# EAGLE schematic MainECU rev12 (EAGLE 9.6.2)

## Sheet 1 of 8
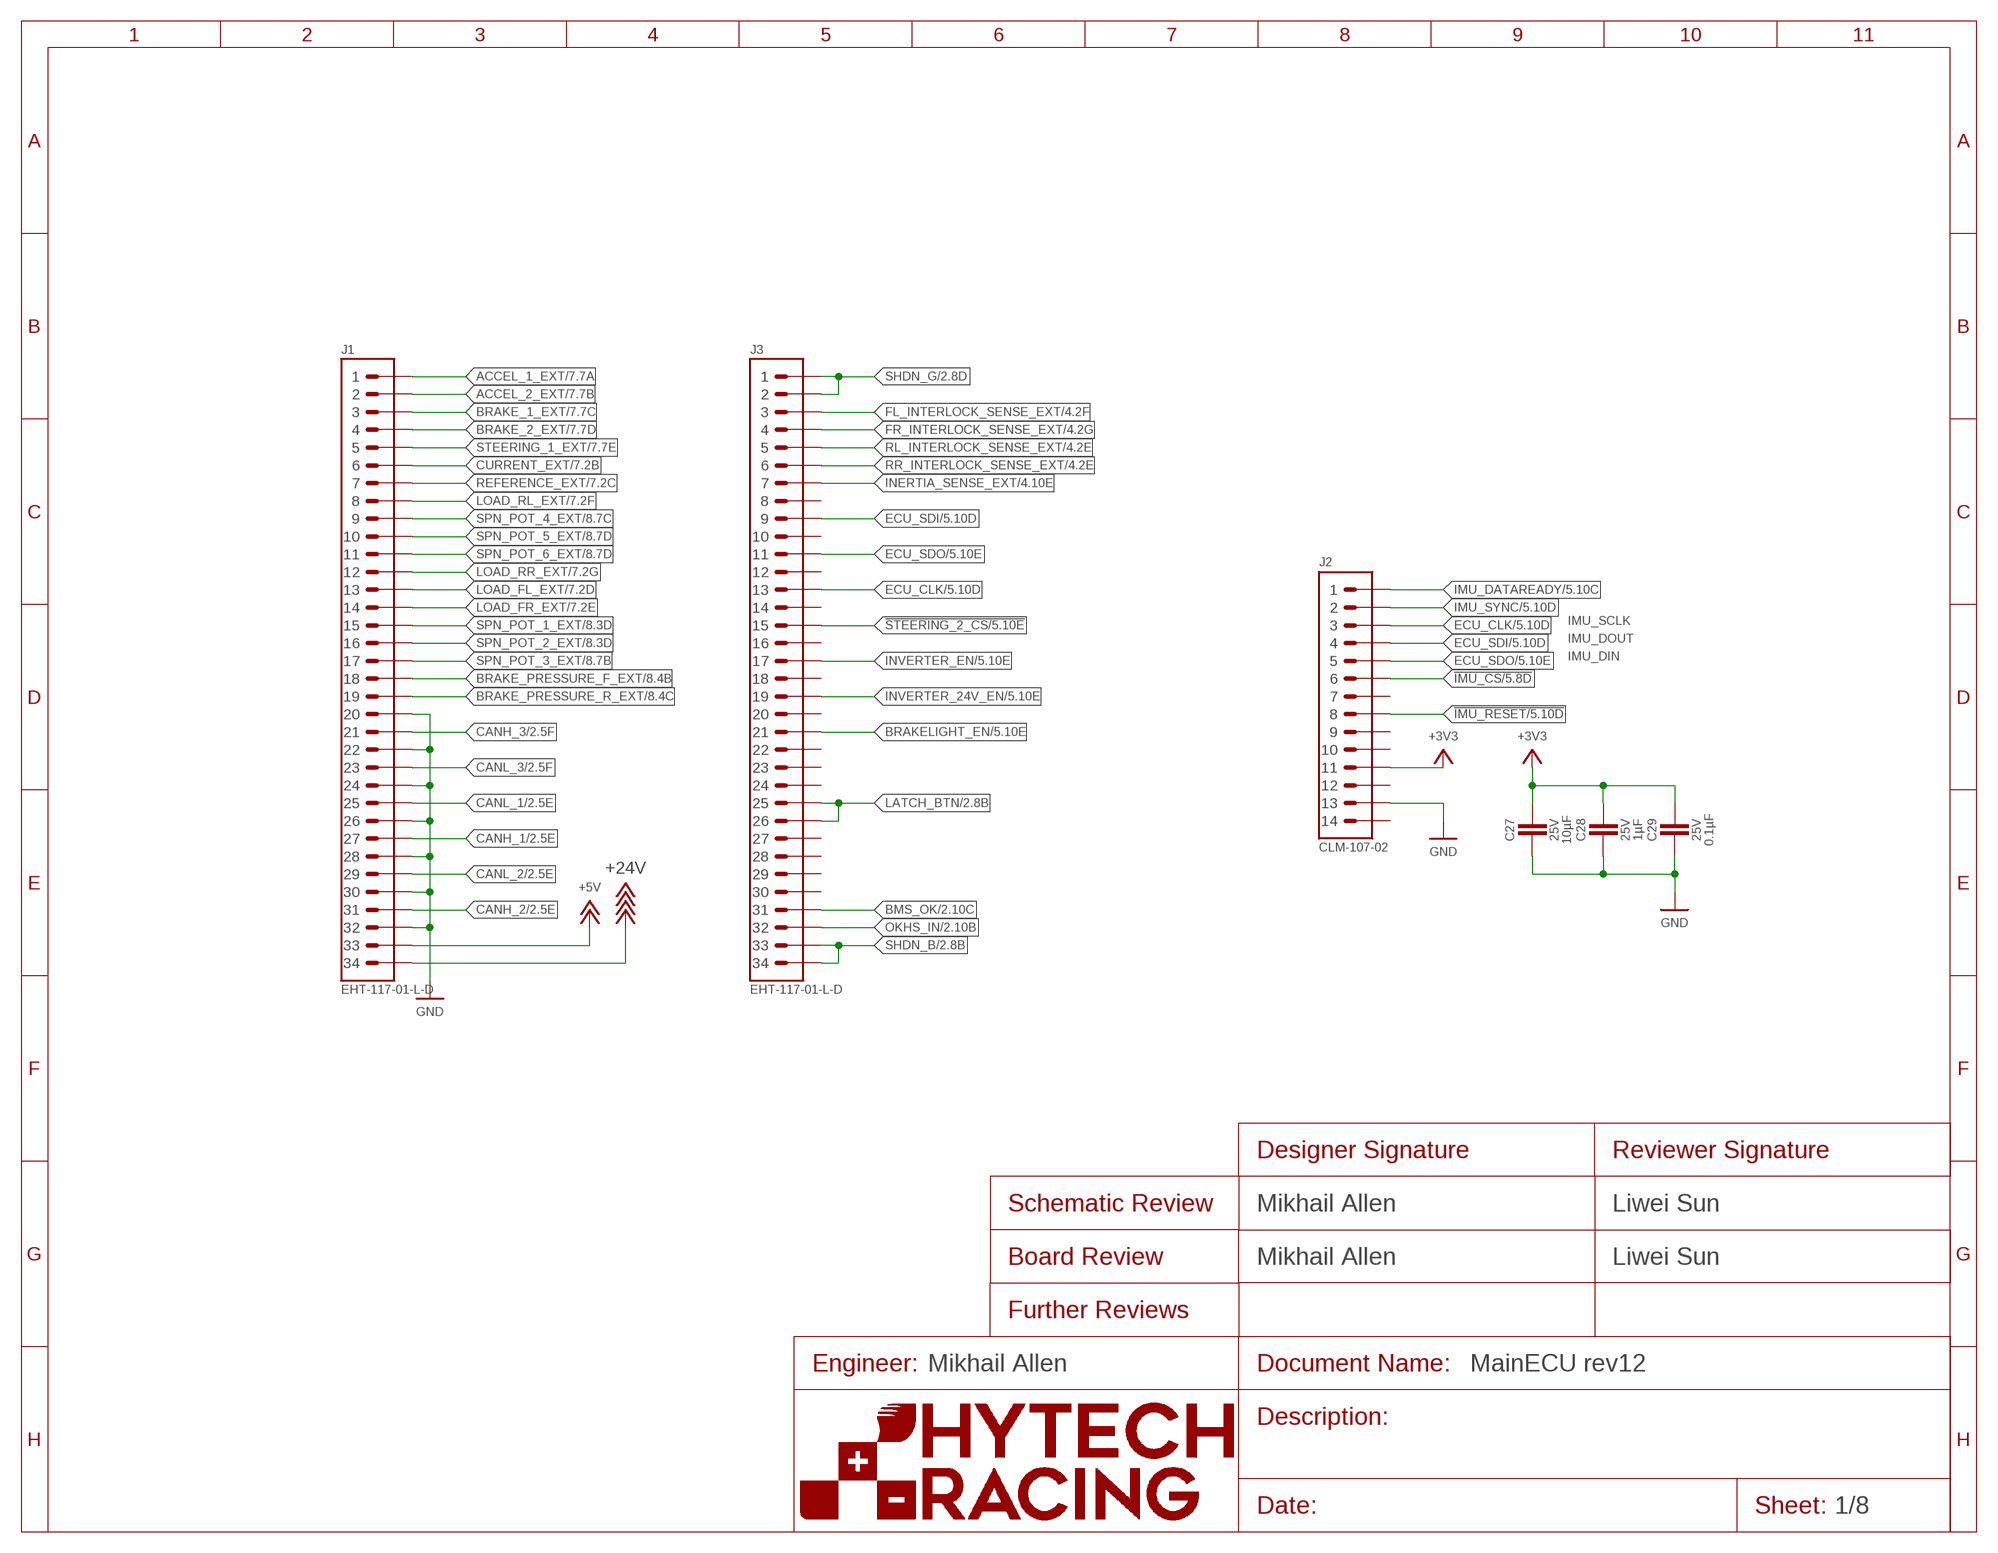
[diagram p0: schematic, sheet 1]
FRAME8 (FRAME): DESIGNER_BOARD: Mikhail Allen; DESIGNER_SCHEMATIC: Mikhail Allen; ENGINEER: Mikhail Allen; REVIEWER_BOARD: Liwei Sun; REVIEWER_SCHEMATIC: Liwei Sun

### Parts
C27  CAPACITOR_0603_25V_10UF  [0603-CAP]
C28  CAPACITOR_0603_25V_1UF  [0603-CAP]
C29  CAPACITOR_0603_25V_0.1UF  [0603-CAP]
J1  CONNECTOR-34__  [EHT-117-01]
J2  ADIS16460  [ADIS16460]
J3  CONNECTOR-34__  [EHT-117-01]

### Nets
!IMU_CS: J2.6 ; also sheet 5
!IMU_RESET: J2.8 ; also sheet 5
!STEERING_2_CS: J3.15 ; also sheet 5
+3V3: C27.1 C28.1 C29.1 J2.11 ; also sheet 2,4,5,6
+5V: J1.33 ; also sheet 2,3,5,6,7
+24V: J1.34 ; also sheet 2,3,4,6
ACCEL_1_EXT: J1.1 ; also sheet 7
ACCEL_2_EXT: J1.2 ; also sheet 7
BMS_OK: J3.31 ; also sheet 2,4
BRAKE_1_EXT: J1.3 ; also sheet 7
BRAKE_2_EXT: J1.4 ; also sheet 7
BRAKE_PRESSURE_F_EXT: J1.18 ; also sheet 8
BRAKE_PRESSURE_R_EXT: J1.19 ; also sheet 8
BRAKELIGHT_EN: J3.21 ; also sheet 5
CANH_1: J1.27 ; also sheet 2,5,6
CANH_2: J1.31 ; also sheet 2,5,6
CANH_3: J1.21 ; also sheet 2,5,6
CANL_1: J1.25 ; also sheet 2,5,6
CANL_2: J1.29 ; also sheet 2,5,6
CANL_3: J1.23 ; also sheet 2,5,6
CURRENT_EXT: J1.6 ; also sheet 7
ECU_CLK: J2.3 J3.13 ; also sheet 5
ECU_SDI: J2.4 J3.9 ; also sheet 5
ECU_SDO: J2.5 J3.11 ; also sheet 5
FL_INTERLOCK_SENSE_EXT: J3.3 ; also sheet 4
FR_INTERLOCK_SENSE_EXT: J3.4 ; also sheet 4
GND: C27.2 C28.2 C29.2 J1.20 J1.22 J1.24 J1.26 J1.28 J1.30 J1.32 J2.13 ; also sheet 2,3,4,5,6,7,8
IMU_DATAREADY: J2.1 ; also sheet 5
IMU_SYNC: J2.2 ; also sheet 5
INERTIA_SENSE_EXT: J3.7 ; also sheet 4
INVERTER_24V_EN: J3.19 ; also sheet 5
INVERTER_EN: J3.17 ; also sheet 5
LATCH_BTN: J3.25 J3.26 ; also sheet 2,4
LOAD_FL_EXT: J1.13 ; also sheet 7
LOAD_FR_EXT: J1.14 ; also sheet 7
LOAD_RL_EXT: J1.8 ; also sheet 7
LOAD_RR_EXT: J1.12 ; also sheet 7
OKHS_IN: J3.32 ; also sheet 2,4
REFERENCE_EXT: J1.7 ; also sheet 7
RL_INTERLOCK_SENSE_EXT: J3.5 ; also sheet 4
RR_INTERLOCK_SENSE_EXT: J3.6 ; also sheet 4
SHDN_B: J3.33 J3.34 ; also sheet 2,4
SHDN_G: J3.1 J3.2 ; also sheet 2,4
SPN_POT_1_EXT: J1.15 ; also sheet 8
SPN_POT_2_EXT: J1.16 ; also sheet 8
SPN_POT_3_EXT: J1.17 ; also sheet 8
SPN_POT_4_EXT: J1.9 ; also sheet 8
SPN_POT_5_EXT: J1.10 ; also sheet 8
SPN_POT_6_EXT: J1.11 ; also sheet 8
STEERING_1_EXT: J1.5 ; also sheet 7
Unconnected: J2.7 J2.9 J2.10 J2.12 J2.14 J3.8 J3.10 J3.12 J3.14 J3.16 J3.18 J3.20 J3.22 J3.23 J3.24 J3.27 J3.28 J3.29 J3.30

### Notes on the sheet
- IMU_SCLK
- IMU_DOUT
- IMU_DIN

## Sheet 2 of 8
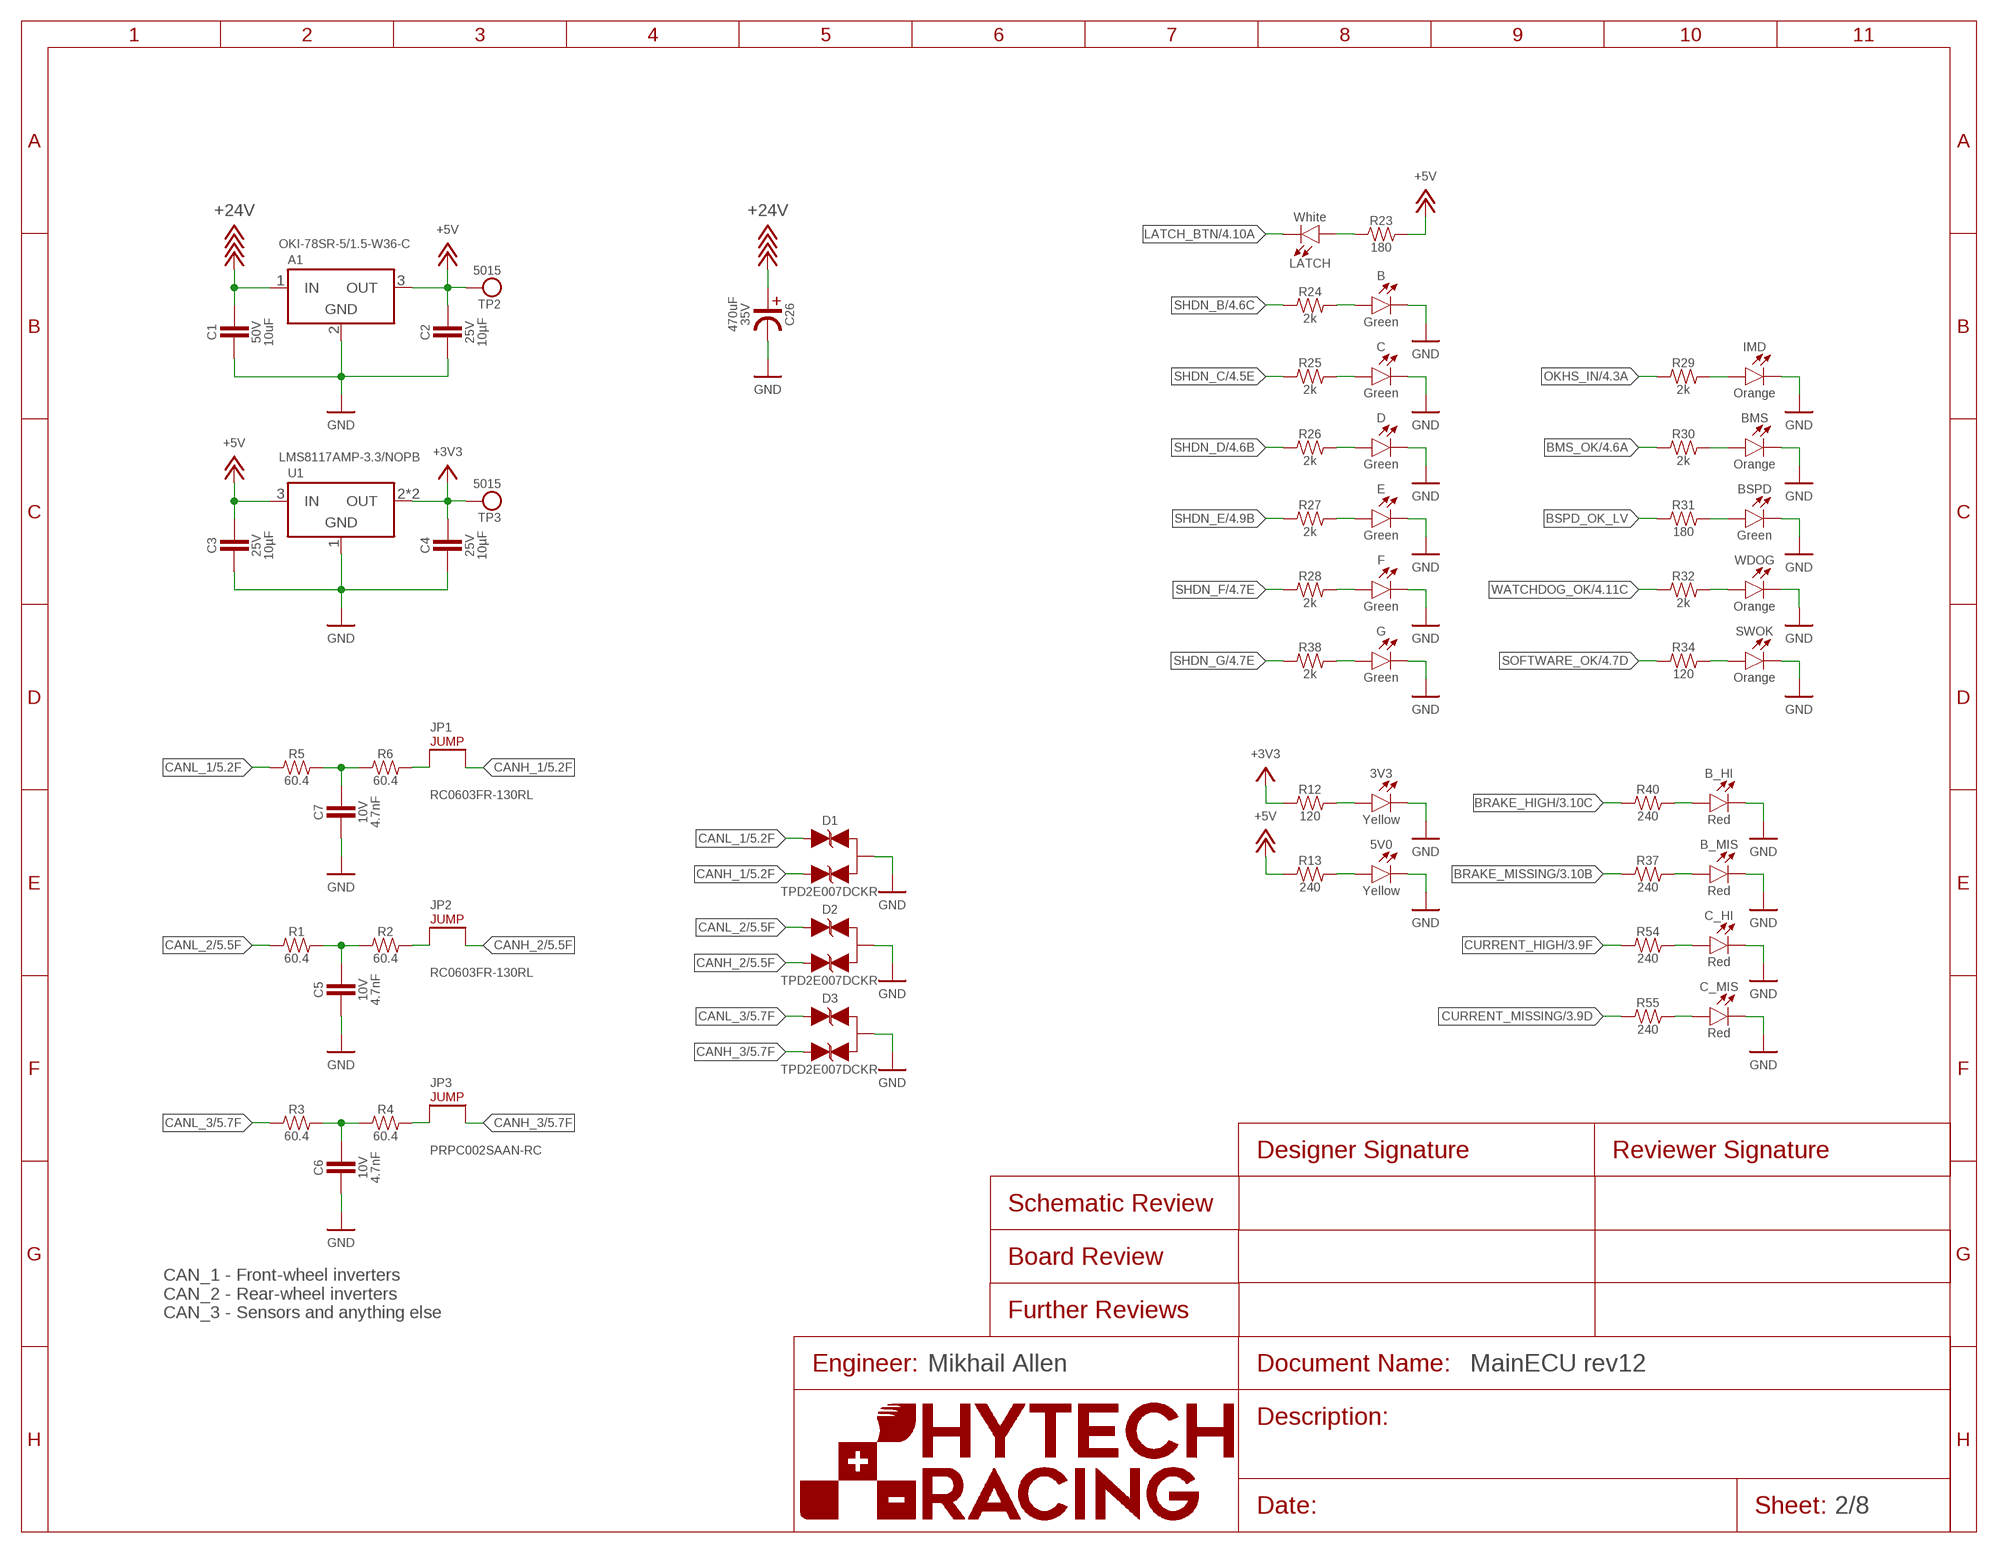
[diagram p1: schematic, sheet 2]
FRAME1 (FRAME): ENGINEER: Mikhail Allen

### Parts
3V3  LED_0603_YELLOW  [0603-LED]
5V0  LED_0603_YELLOW  [0603-LED]
A1  VOLTAGE_REGULATOR_MODULE_OKI-78SR_5V  [OKI-78SR]
B  LED_0603_GREEN  [0603-LED]
B_HI  LED_0603_RED  [0603-LED]
B_MIS  LED_0603_RED  [0603-LED]
BMS  LED_0603_ORANGE  [0603-LED]
BSPD  LED_0603_GREEN  [0603-LED]
C  LED_0603_GREEN  [0603-LED]
C1  CAPACITOR_0805_50V_10UF  [0805-CAP]
C2  CAPACITOR_0603_25V_10UF  [0603-CAP]
C3  CAPACITOR_0603_25V_10UF  [0603-CAP]
C4  CAPACITOR_0603_25V_10UF  [0603-CAP]
C5  CAPACITOR_0603_10V_4.7NF  [0603-CAP]
C6  CAPACITOR_0603_10V_4.7NF  [0603-CAP]
C7  CAPACITOR_0603_10V_4.7NF  [0603-CAP]
C26  CAPACITOR_ELECTROLYTIC_EEH_AZS_470UF  [EEH-AZS]
C_HI  LED_0603_RED  [0603-LED]
C_MIS  LED_0603_RED  [0603-LED]
D  LED_0603_GREEN  [0603-LED]
D1  TVS_BIDIRECTIONAL_DUAL  [SC-70-3]
D2  TVS_BIDIRECTIONAL_DUAL  [SC-70-3]
D3  TVS_BIDIRECTIONAL_DUAL  [SC-70-3]
E  LED_0603_GREEN  [0603-LED]
F  LED_0603_GREEN  [0603-LED]
G  LED_0603_GREEN  [0603-LED]
IMD  LED_0603_ORANGE  [0603-LED]
JP1  JUMPER_0603_  [0603-RES]
JP2  JUMPER_0603_  [0603-RES]
JP3  JUMPER__1X02  [1X02]
LATCH  LED_0603_WHITE  [0603-LED]
R1  RESISTOR_0603_60.4  [0603-RES]
R2  RESISTOR_0603_60.4  [0603-RES]
R3  RESISTOR_0603_60.4  [0603-RES]
R4  RESISTOR_0603_60.4  [0603-RES]
R5  RESISTOR_0603_60.4  [0603-RES]
R6  RESISTOR_0603_60.4  [0603-RES]
R12  RESISTOR_0603_120  [0603-RES]
R13  RESISTOR_0603_240  [0603-RES]
R23  RESISTOR_0603_180  [0603-RES]
R24  RESISTOR_0603_2K  [0603-RES]
R25  RESISTOR_0603_2K  [0603-RES]
R26  RESISTOR_0603_2K  [0603-RES]
R27  RESISTOR_0603_2K  [0603-RES]
R28  RESISTOR_0603_2K  [0603-RES]
R29  RESISTOR_0603_2K  [0603-RES]
R30  RESISTOR_0603_2K  [0603-RES]
R31  RESISTOR_0603_180  [0603-RES]
R32  RESISTOR_0603_2K  [0603-RES]
R34  RESISTOR_0603_120  [0603-RES]
R37  RESISTOR_0603_240  [0603-RES]
R38  RESISTOR_0603_2K  [0603-RES]
R40  RESISTOR_0603_240  [0603-RES]
R54  RESISTOR_0603_240  [0603-RES]
R55  RESISTOR_0603_240  [0603-RES]
SWOK  LED_0603_ORANGE  [0603-LED]
TP2  TEST_POINT  [5015]
TP3  TEST_POINT  [5015]
U1  VOLTAGE_REGULATOR_SOT-223_3.3V  [SOT-223]
WDOG  LED_0603_ORANGE  [0603-LED]

### Nets
+3V3: C4.1 R12.1 TP3.1 U1.2(OUT) U1.4(OUT) ; also sheet 1,4,5,6
+5V: A1.3(OUT) C2.1 C3.1 R13.1 R23.2 TP2.1 U1.3(IN) ; also sheet 1,3,5,6,7
+24V: A1.1(IN) C1.1 C26.PLUS ; also sheet 1,3,4,6
BMS_OK: R30.1 ; also sheet 1,4
BRAKE_HIGH: R40.1 ; also sheet 3
BRAKE_MISSING: R37.1 ; also sheet 3
BSPD_OK_LV: R31.1 ; also sheet 3
CANH_1: D1.2(C2) JP1.2 ; also sheet 1,5,6
CANH_2: D2.2(C2) JP2.2 ; also sheet 1,5,6
CANH_3: D3.2(C2) JP3.2 ; also sheet 1,5,6
CANL_1: D1.1(C1) R5.1 ; also sheet 1,5,6
CANL_2: D2.1(C1) R1.1 ; also sheet 1,5,6
CANL_3: D3.1(C1) R3.1 ; also sheet 1,5,6
CURRENT_HIGH: R54.1 ; also sheet 3
CURRENT_MISSING: R55.1 ; also sheet 3
GND: 3V3.1(C) 5V0.1(C) A1.2(GND) B.1(C) B_HI.1(C) B_MIS.1(C) BMS.1(C) BSPD.1(C) C1.2 C2.2 C3.2 C4.2 C5.2 C6.2 C7.2 C26.MINUS C.1(C) C_HI.1(C) C_MIS.1(C) D1.3(A) D2.3(A) D3.3(A) D.1(C) E.1(C) F.1(C) G.1(C) IMD.1(C) SWOK.1(C) U1.1(GND) WDOG.1(C) ; also sheet 1,3,4,5,6,7,8
LATCH_BTN: LATCH.1(C) ; also sheet 1,4
N$1: JP1.1 R6.2
N$2: JP2.1 R2.2
N$6: JP3.1 R4.2
N$7: C5.1 R1.2 R2.1
N$8: C6.1 R3.2 R4.1
N$9: C7.1 R5.2 R6.1
N$13: G.2(A) R38.2
N$15: LATCH.2(A) R23.1
N$16: B.2(A) R24.2
N$17: C.2(A) R25.2
N$18: D.2(A) R26.2
N$19: E.2(A) R27.2
N$20: F.2(A) R28.2
N$28: B_MIS.2(A) R37.2
N$29: C_HI.2(A) R54.2
N$30: C_MIS.2(A) R55.2
N$40: IMD.2(A) R29.2
N$41: BMS.2(A) R30.2
N$42: BSPD.2(A) R31.2
N$43: R32.2 WDOG.2(A)
N$44: 3V3.2(A) R12.2
N$45: R34.2 SWOK.2(A)
N$47: 5V0.2(A) R13.2
N$56: B_HI.2(A) R40.2
OKHS_IN: R29.1 ; also sheet 1,4
SHDN_B: R24.1 ; also sheet 1,4
SHDN_C: R25.1 ; also sheet 4
SHDN_D: R26.1 ; also sheet 4
SHDN_E: R27.1 ; also sheet 4
SHDN_F: R28.1 ; also sheet 4
SHDN_G: R38.1 ; also sheet 1,4
SOFTWARE_OK: R34.1 ; also sheet 4,5
WATCHDOG_OK: R32.1 ; also sheet 4

### Notes on the sheet
- CAN_1 - Front-wheel inverters
  CAN_2 - Rear-wheel inverters
  CAN_3 - Sensors and anything else

## Sheet 3 of 8
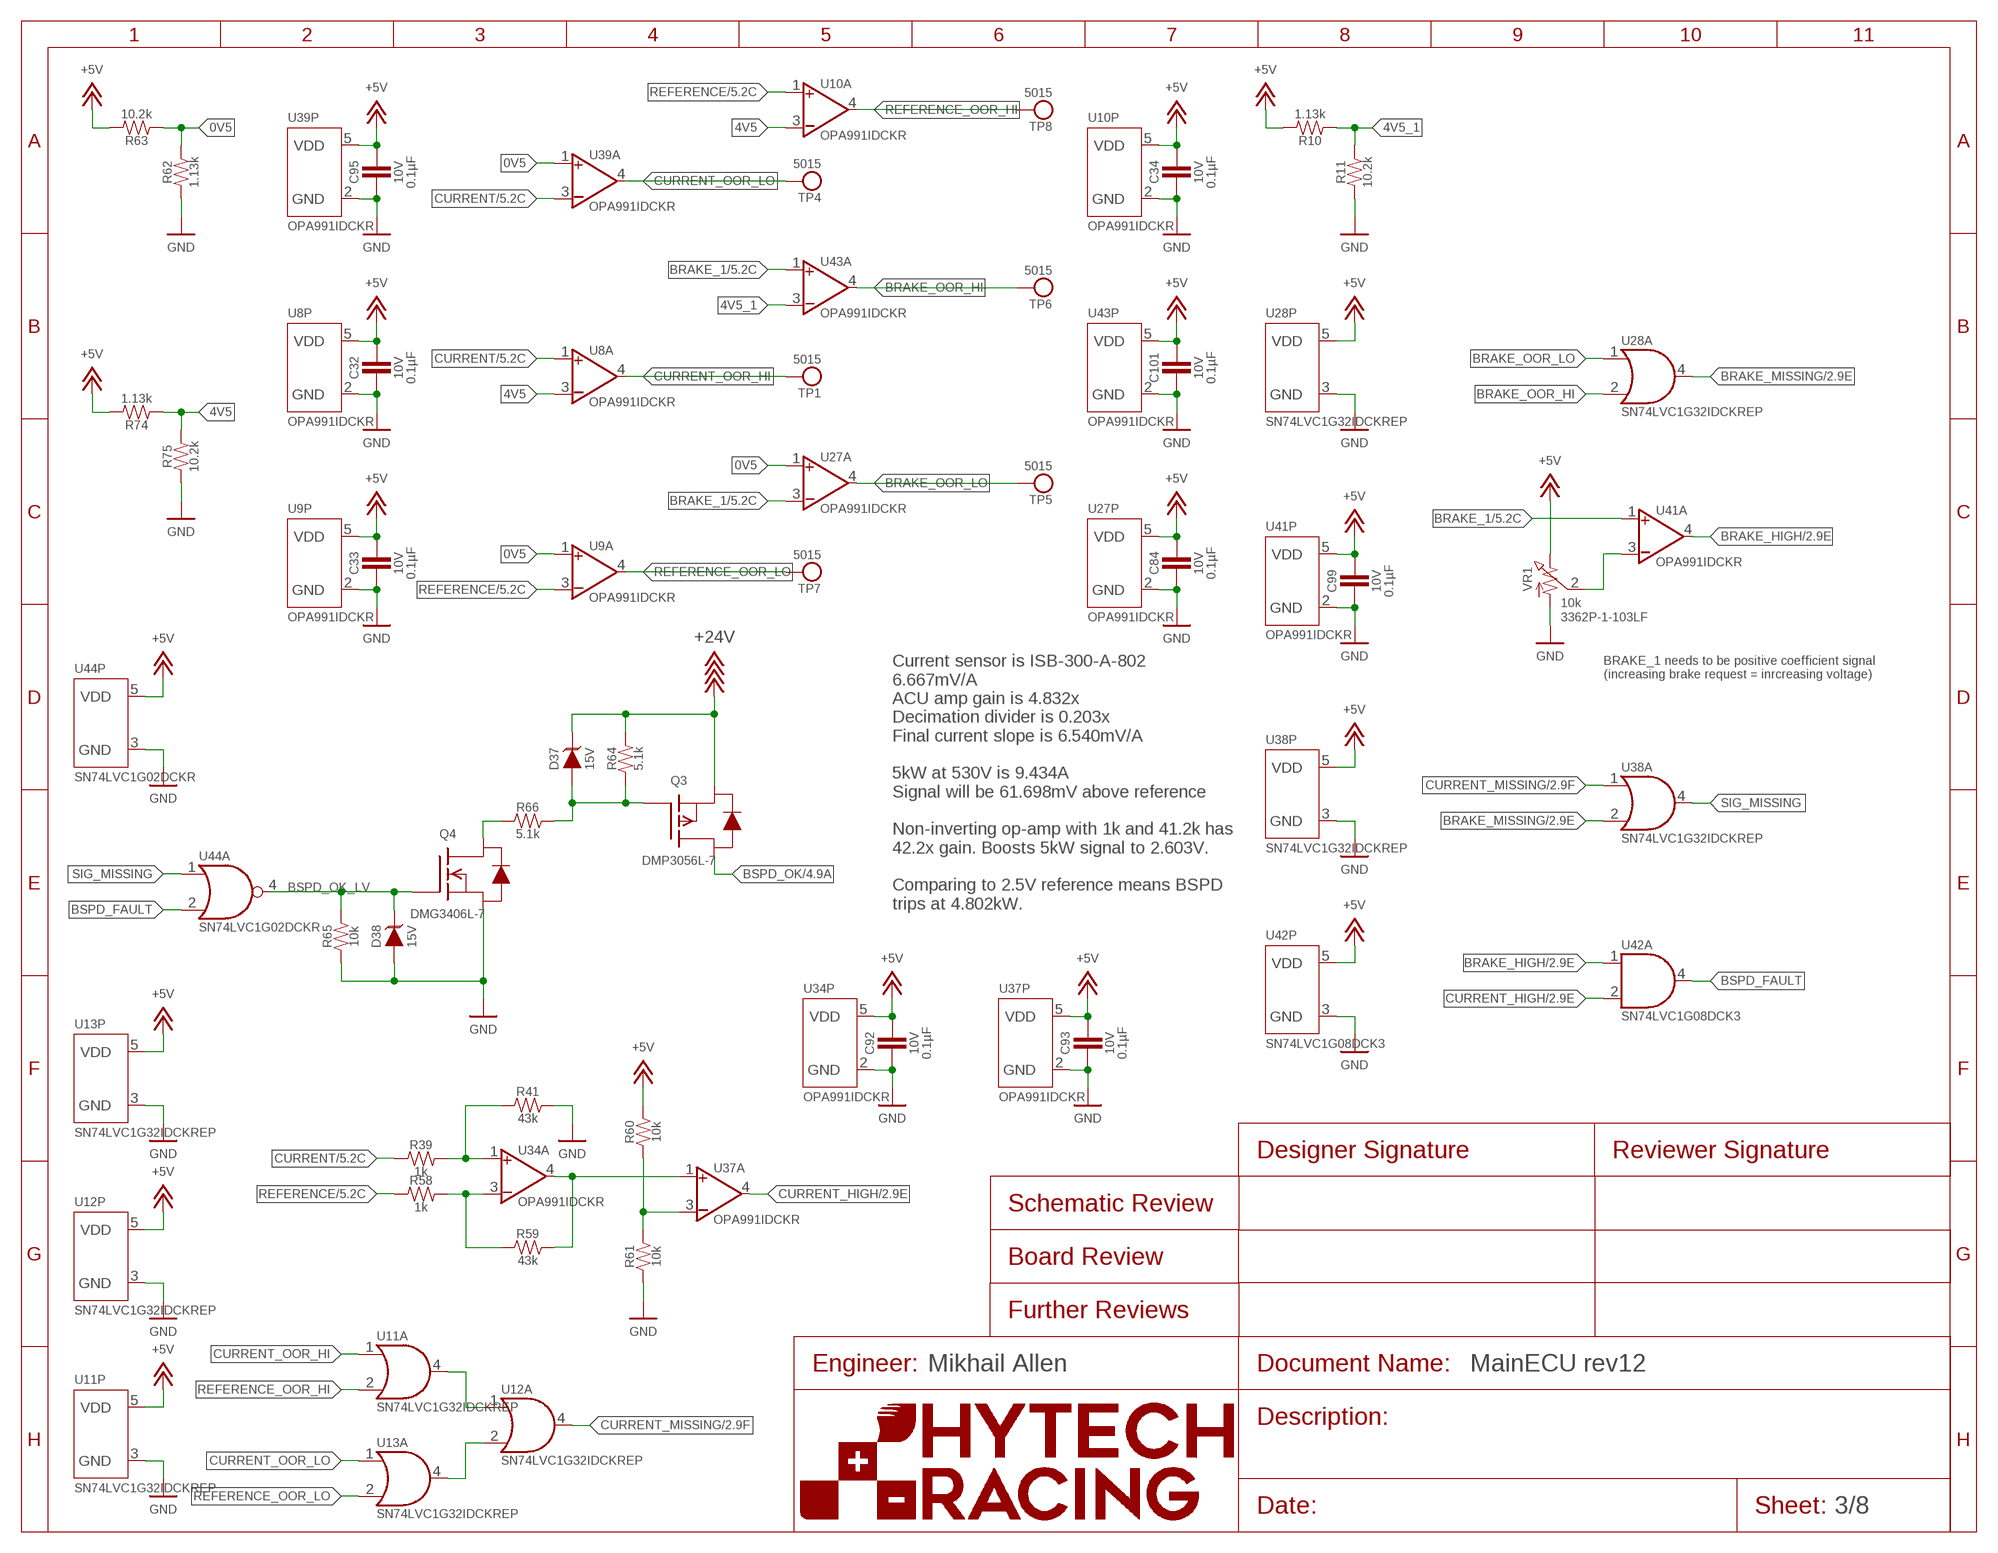
[diagram p2: schematic, sheet 3]
FRAME7 (FRAME): ENGINEER: Mikhail Allen

### Parts
C32  CAPACITOR_0603_10V_0.1UF  [0603-CAP]
C33  CAPACITOR_0603_10V_0.1UF  [0603-CAP]
C34  CAPACITOR_0603_10V_0.1UF  [0603-CAP]
C84  CAPACITOR_0603_10V_0.1UF  [0603-CAP]
C92  CAPACITOR_0603_10V_0.1UF  [0603-CAP]
C93  CAPACITOR_0603_10V_0.1UF  [0603-CAP]
C95  CAPACITOR_0603_10V_0.1UF  [0603-CAP]
C99  CAPACITOR_0603_10V_0.1UF  [0603-CAP]
C101  CAPACITOR_0603_10V_0.1UF  [0603-CAP]
D37  TVS__15V  [SOT-23]
D38  TVS__15V  [SOT-23]
Q3  TRANSISTOR_P_MOS_SOT-23_DMP3056L-7  [SOT-23]
Q4  TRANSISTOR_N_MOS__DMG3406L-7  [SOT-23]
R10  RESISTOR_0603_1.13K  [0603-RES]
R11  RESISTOR_0603_10.2K  [0603-RES]
R39  RESISTOR_0603_1K  [0603-RES]
R41  RESISTOR_0603_43K  [0603-RES]
R58  RESISTOR_0603_1K  [0603-RES]
R59  RESISTOR_0603_43K  [0603-RES]
R60  RESISTOR_0603_10K  [0603-RES]
R61  RESISTOR_0603_10K  [0603-RES]
R62  RESISTOR_0603_1.13K  [0603-RES]
R63  RESISTOR_0603_10.2K  [0603-RES]
R64  RESISTOR_0603_5.1K  [0603-RES]
R65  RESISTOR_0603_10K  [0603-RES]
R66  RESISTOR_0603_5.1K  [0603-RES]
R74  RESISTOR_0603_1.13K  [0603-RES]
R75  RESISTOR_0603_10.2K  [0603-RES]
TP1  TEST_POINT  [5015]
TP4  TEST_POINT  [5015]
TP5  TEST_POINT  [5015]
TP6  TEST_POINT  [5015]
TP7  TEST_POINT  [5015]
TP8  TEST_POINT  [5015]
U8  OPAMP_1_CHANNEL_OPA991  [SC-70-5]
U9  OPAMP_1_CHANNEL_OPA991  [SC-70-5]
U10  OPAMP_1_CHANNEL_OPA991  [SC-70-5]
U11  LOGICGATE_OR  [SC-70-5]
U12  LOGICGATE_OR  [SC-70-5]
U13  LOGICGATE_OR  [SC-70-5]
U27  OPAMP_1_CHANNEL_OPA991  [SC-70-5]
U28  LOGICGATE_OR  [SC-70-5]
U34  OPAMP_1_CHANNEL_OPA991  [SC-70-5]
U37  OPAMP_1_CHANNEL_OPA991  [SC-70-5]
U38  LOGICGATE_OR  [SC-70-5]
U39  OPAMP_1_CHANNEL_OPA991  [SC-70-5]
U41  OPAMP_1_CHANNEL_OPA991  [SC-70-5]
U42  LOGICGATE_AND_DCK3  [SC-70-5]
U43  OPAMP_1_CHANNEL_OPA991  [SC-70-5]
U44  LOGICGATE_NOR  [SC-70-5]
VR1  RESISTOR_TRIMPOT_10K_3362P  [3362P]

### Nets
0V5: R62.2 R63.1 U9.1(A:VIN+) U27.1(A:VIN+) U39.1(A:VIN+)
4V5: R74.1 R75.2 U8.3(A:VIN-) U10.3(A:VIN-)
4V5_1: R10.1 R11.2 U43.3(A:VIN-)
+5V: C32.1 C33.1 C34.1 C84.1 C92.1 C93.1 C95.1 C99.1 C101.1 R10.2 R60.2 R63.2 R74.2 U8.5(P:VDD) U9.5(P:VDD) U10.5(P:VDD) U11.5(P:VDD) U12.5(P:VDD) U13.5(P:VDD) U27.5(P:VDD) U28.5(P:VDD) U34.5(P:VDD) U37.5(P:VDD) U38.5(P:VDD) U39.5(P:VDD) U41.5(P:VDD) U42.5(P:VDD) U43.5(P:VDD) U44.5(P:VDD) VR1.3 ; also sheet 1,2,5,6,7
+24V: D37.3(C) Q3.2(S) R64.2 ; also sheet 1,2,4,6
BRAKE_1: U27.3(A:VIN-) U41.1(A:VIN+) U43.1(A:VIN+) ; also sheet 5,7
BRAKE_HIGH: U41.4(A:VOUT) U42.1(A:IN1) ; also sheet 2
BRAKE_MISSING: U28.4(A:OUT) U38.2(A:IN2) ; also sheet 2
BRAKE_OOR_HI: TP6.1 U28.2(A:IN2) U43.4(A:VOUT)
BRAKE_OOR_LO: TP5.1 U27.4(A:VOUT) U28.1(A:IN1)
BSPD_FAULT: U42.4(A:OUT) U44.2(A:IN2)
BSPD_OK: Q3.3(D) ; also sheet 4
BSPD_OK_LV: D38.3(C) Q4.1(G) R65.2 U44.4(A:OUT) ; also sheet 2
CURRENT: R39.1 U8.1(A:VIN+) U39.3(A:VIN-) ; also sheet 5,6,7
CURRENT_HIGH: U37.4(A:VOUT) U42.2(A:IN2) ; also sheet 2
CURRENT_MISSING: U12.4(A:OUT) U38.1(A:IN1) ; also sheet 2
CURRENT_OOR_HI: TP1.1 U8.4(A:VOUT) U11.1(A:IN1)
CURRENT_OOR_LO: TP4.1 U13.1(A:IN1) U39.4(A:VOUT)
GND: C32.2 C33.2 C34.2 C84.2 C92.2 C93.2 C95.2 C99.2 C101.2 D38.1(A) Q4.2(S) R11.1 R41.2 R61.1 R62.1 R65.1 R75.1 U8.2(P:GND) U9.2(P:GND) U10.2(P:GND) U11.3(P:GND) U12.3(P:GND) U13.3(P:GND) U27.2(P:GND) U28.3(P:GND) U34.2(P:GND) U37.2(P:GND) U38.3(P:GND) U39.2(P:GND) U41.2(P:GND) U42.3(P:GND) U43.2(P:GND) U44.3(P:GND) VR1.1 ; also sheet 1,2,4,5,6,7,8
N$26: R39.2 R41.1 U34.1(A:VIN+)
N$65: R60.1 R61.2 U37.3(A:VIN-)
N$67: R58.2 R59.1 U34.3(A:VIN-)
N$68: R59.2 U34.4(A:VOUT) U37.1(A:VIN+)
N$73: U41.3(A:VIN-) VR1.2
N$74: D37.1(A) Q3.1(G) R64.1 R66.2
N$75: Q4.3(D) R66.1
OOR_HI: U11.4(A:OUT) U12.1(A:IN1)
OOR_LO: U12.2(A:IN2) U13.4(A:OUT)
REFERENCE: R58.1 U9.3(A:VIN-) U10.1(A:VIN+) ; also sheet 5,6,7
REFERENCE_OOR_HI: TP8.1 U10.4(A:VOUT) U11.2(A:IN2)
REFERENCE_OOR_LO: TP7.1 U9.4(A:VOUT) U13.2(A:IN2)
SIG_MISSING: U38.4(A:OUT) U44.1(A:IN1)

### Notes on the sheet
- BRAKE_1 needs to be positive coefficient signal
  (increasing brake request = inrcreasing voltage)
- Current sensor is ISB-300-A-802
  6.667mV/A
  ACU amp gain is 4.832x
  Decimation divider is 0.203x
  Final current slope is 6.540mV/A
  
  5kW at 530V is 9.434A
  Signal will be 61.698mV above reference
  
  Non-inverting op-amp with 1k and 41.2k has
  42.2x gain. Boosts 5kW signal to 2.603V.
  
  Comparing to 2.5V reference means BSPD
  trips at 4.802kW.

## Sheet 4 of 8
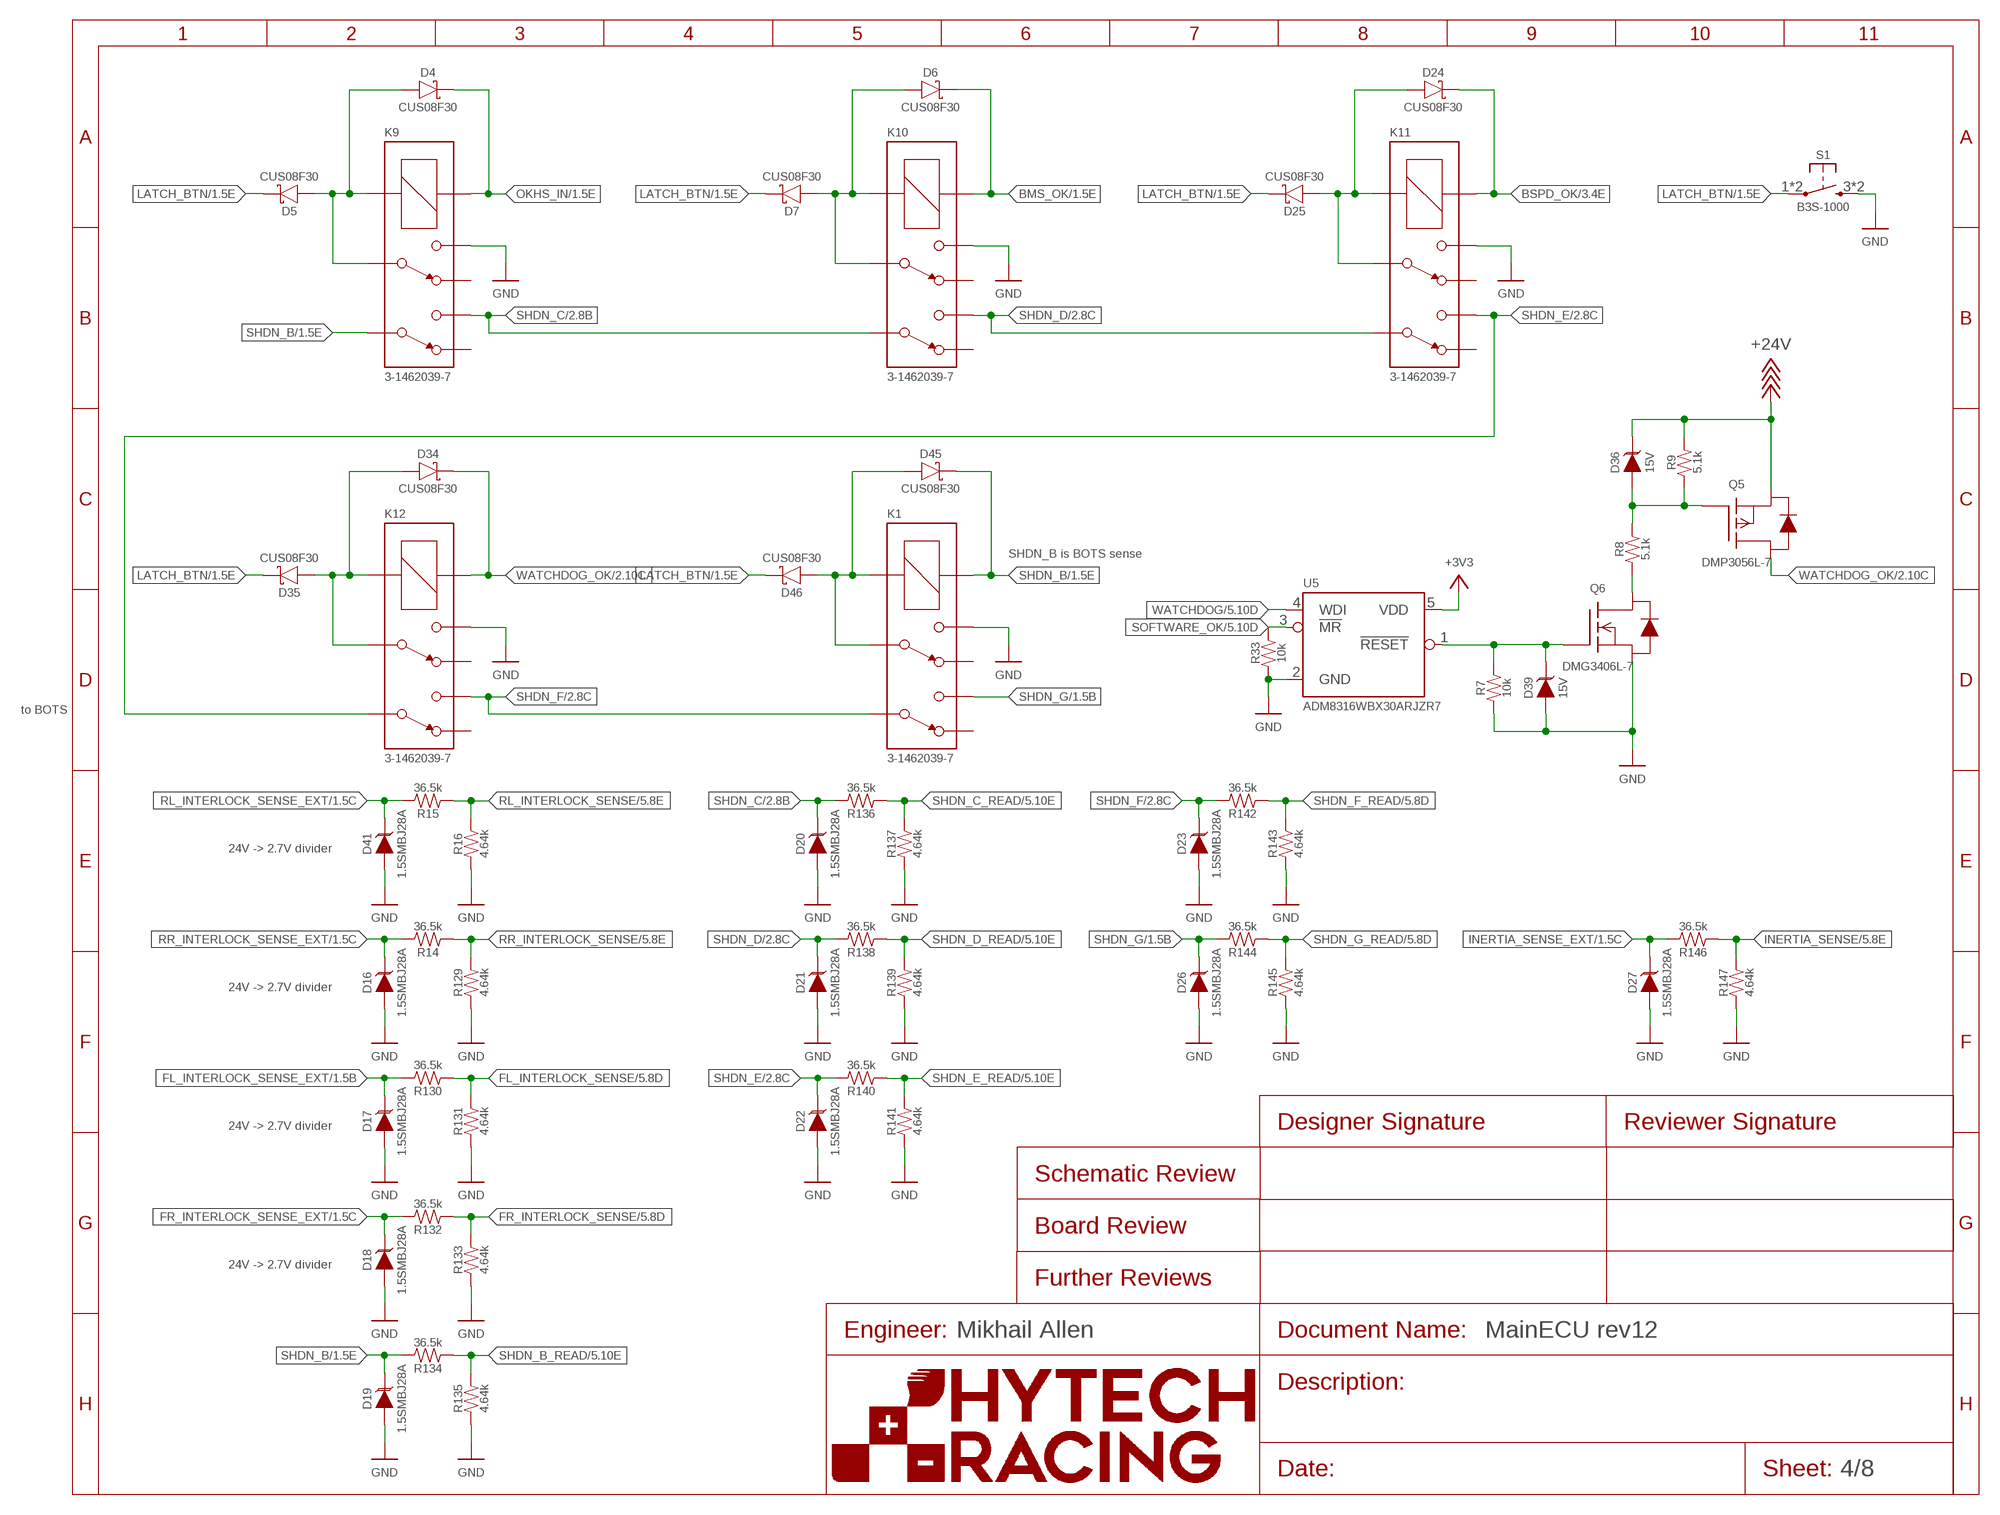
[diagram p3: schematic, sheet 4]
FRAME2 (FRAME): ENGINEER: Mikhail Allen

### Parts
D4  SCHOTTKY_SOD323_30V  [SOD-323]
D5  SCHOTTKY_SOD323_30V  [SOD-323]
D6  SCHOTTKY_SOD323_30V  [SOD-323]
D7  SCHOTTKY_SOD323_30V  [SOD-323]
D16  TVS_DO-214AA_28V  [DO-214AA]
D17  TVS_DO-214AA_28V  [DO-214AA]
D18  TVS_DO-214AA_28V  [DO-214AA]
D19  TVS_DO-214AA_28V  [DO-214AA]
D20  TVS_DO-214AA_28V  [DO-214AA]
D21  TVS_DO-214AA_28V  [DO-214AA]
D22  TVS_DO-214AA_28V  [DO-214AA]
D23  TVS_DO-214AA_28V  [DO-214AA]
D24  SCHOTTKY_SOD323_30V  [SOD-323]
D25  SCHOTTKY_SOD323_30V  [SOD-323]
D26  TVS_DO-214AA_28V  [DO-214AA]
D27  TVS_DO-214AA_28V  [DO-214AA]
D34  SCHOTTKY_SOD323_30V  [SOD-323]
D35  SCHOTTKY_SOD323_30V  [SOD-323]
D36  TVS__15V  [SOT-23]
D39  TVS__15V  [SOT-23]
D41  TVS_DO-214AA_28V  [DO-214AA]
D45  SCHOTTKY_SOD323_30V  [SOD-323]
D46  SCHOTTKY_SOD323_30V  [SOD-323]
K1  RELAY_DPDT_07DSMT  [IM*G]
K9  RELAY_DPDT_07DSMT  [IM*G]
K10  RELAY_DPDT_07DSMT  [IM*G]
K11  RELAY_DPDT_07DSMT  [IM*G]
K12  RELAY_DPDT_07DSMT  [IM*G]
Q5  TRANSISTOR_P_MOS_SOT-23_DMP3056L-7  [SOT-23]
Q6  TRANSISTOR_N_MOS__DMG3406L-7  [SOT-23]
R7  RESISTOR_0603_10K  [0603-RES]
R8  RESISTOR_0603_5.1K  [0603-RES]
R9  RESISTOR_0603_5.1K  [0603-RES]
R14  RESISTOR_0603_36.5K  [0603-RES]
R15  RESISTOR_0603_36.5K  [0603-RES]
R16  RESISTOR_0603_4.64K  [0603-RES]
R33  RESISTOR_0603_10K  [0603-RES]
R129  RESISTOR_0603_4.64K  [0603-RES]
R130  RESISTOR_0603_36.5K  [0603-RES]
R131  RESISTOR_0603_4.64K  [0603-RES]
R132  RESISTOR_0603_36.5K  [0603-RES]
R133  RESISTOR_0603_4.64K  [0603-RES]
R134  RESISTOR_0603_36.5K  [0603-RES]
R135  RESISTOR_0603_4.64K  [0603-RES]
R136  RESISTOR_0603_36.5K  [0603-RES]
R137  RESISTOR_0603_4.64K  [0603-RES]
R138  RESISTOR_0603_36.5K  [0603-RES]
R139  RESISTOR_0603_4.64K  [0603-RES]
R140  RESISTOR_0603_36.5K  [0603-RES]
R141  RESISTOR_0603_4.64K  [0603-RES]
R142  RESISTOR_0603_36.5K  [0603-RES]
R143  RESISTOR_0603_4.64K  [0603-RES]
R144  RESISTOR_0603_36.5K  [0603-RES]
R145  RESISTOR_0603_4.64K  [0603-RES]
R146  RESISTOR_0603_36.5K  [0603-RES]
R147  RESISTOR_0603_4.64K  [0603-RES]
S1  BUTTON  [B3S-100X]
U5  ADM8316WBX30  [SOT-23-5]

### Nets
+3V3: U5.5(VDD) ; also sheet 1,2,5,6
+24V: D36.3(C) Q5.2(S) R9.2 ; also sheet 1,2,3,6
BMS_OK: D6.C K10.1(COIL+) ; also sheet 1,2
BSPD_OK: D24.C K11.1(COIL+) ; also sheet 3
FL_INTERLOCK_SENSE: R130.1 R131.2 ; also sheet 5
FL_INTERLOCK_SENSE_EXT: D17.2(C) R130.2 ; also sheet 1
FR_INTERLOCK_SENSE: R132.1 R133.2 ; also sheet 5
FR_INTERLOCK_SENSE_EXT: D18.2(C) R132.2 ; also sheet 1
GND: D16.1(A) D17.1(A) D18.1(A) D19.1(A) D20.1(A) D21.1(A) D22.1(A) D23.1(A) D26.1(A) D27.1(A) D39.1(A) D41.1(A) K1.4 K9.4 K10.4 K11.4 K12.4 Q6.2(S) R7.1 R16.1 R33.1 R129.1 R131.1 R133.1 R135.1 R137.1 R139.1 R141.1 R143.1 R145.1 R147.1 S1.3(S) S1.4(S) U5.2(GND) ; also sheet 1,2,3,5,6,7,8
INERTIA_SENSE: R146.1 R147.2 ; also sheet 5
INERTIA_SENSE_EXT: D27.2(C) R146.2 ; also sheet 1
LATCH_BTN: D5.C D7.C D25.C D35.C D46.C S1.1(P) S1.2(P) ; also sheet 1,2
N$4: D36.1(A) Q5.1(G) R8.2 R9.1
N$5: Q6.3(D) R8.1
N$21: D4.A D5.A K9.3 K9.8(COIL-)
N$22: D24.A D25.A K11.3 K11.8(COIL-)
N$23: D6.A D7.A K10.3 K10.8(COIL-)
N$24: D45.A D46.A K1.3 K1.8(COIL-)
N$25: D34.A D35.A K12.3 K12.8(COIL-)
OKHS_IN: D4.C K9.1(COIL+) ; also sheet 1,2
RL_INTERLOCK_SENSE: R15.1 R16.2 ; also sheet 5
RL_INTERLOCK_SENSE_EXT: D41.2(C) R15.2 ; also sheet 1
RR_INTERLOCK_SENSE: R14.1 R129.2 ; also sheet 5
RR_INTERLOCK_SENSE_EXT: D16.2(C) R14.2 ; also sheet 1
SHDN_B: D19.2(C) D45.C K1.1(COIL+) K9.6 R134.2 ; also sheet 1,2
SHDN_B_READ: R134.1 R135.2 ; also sheet 5
SHDN_C: D20.2(C) K9.5 K10.6 R136.2 ; also sheet 2
SHDN_C_READ: R136.1 R137.2 ; also sheet 5
SHDN_D: D21.2(C) K10.5 K11.6 R138.2 ; also sheet 2
SHDN_D_READ: R138.1 R139.2 ; also sheet 5
SHDN_E: D22.2(C) K11.5 K12.6 R140.2 ; also sheet 2
SHDN_E_READ: R140.1 R141.2 ; also sheet 5
SHDN_F: D23.2(C) K1.6 K12.5 R142.2 ; also sheet 2
SHDN_F_READ: R142.1 R143.2 ; also sheet 5
SHDN_G: D26.2(C) K1.5 R144.2 ; also sheet 1,2
SHDN_G_READ: R144.1 R145.2 ; also sheet 5
SOFTWARE_OK: R33.2 U5.3(!MR!) ; also sheet 2,5
WATCHDOG: U5.4(WDI) ; also sheet 5
WATCHDOG_OK: D34.C K12.1(COIL+) Q5.3(D) ; also sheet 2
WATCHDOG_OK_LV: D39.3(C) Q6.1(G) R7.2 U5.1(!RESET!)
Unconnected: K1.2 K1.7 K9.2 K9.7 K10.2 K10.7 K11.2 K11.7 K12.2 K12.7

### Notes on the sheet
- SHDN_B is BOTS sense
- to BOTS
- 24V -> 2.7V divider
- 24V -> 2.7V divider
- 24V -> 2.7V divider
- 24V -> 2.7V divider

## Sheet 5 of 8
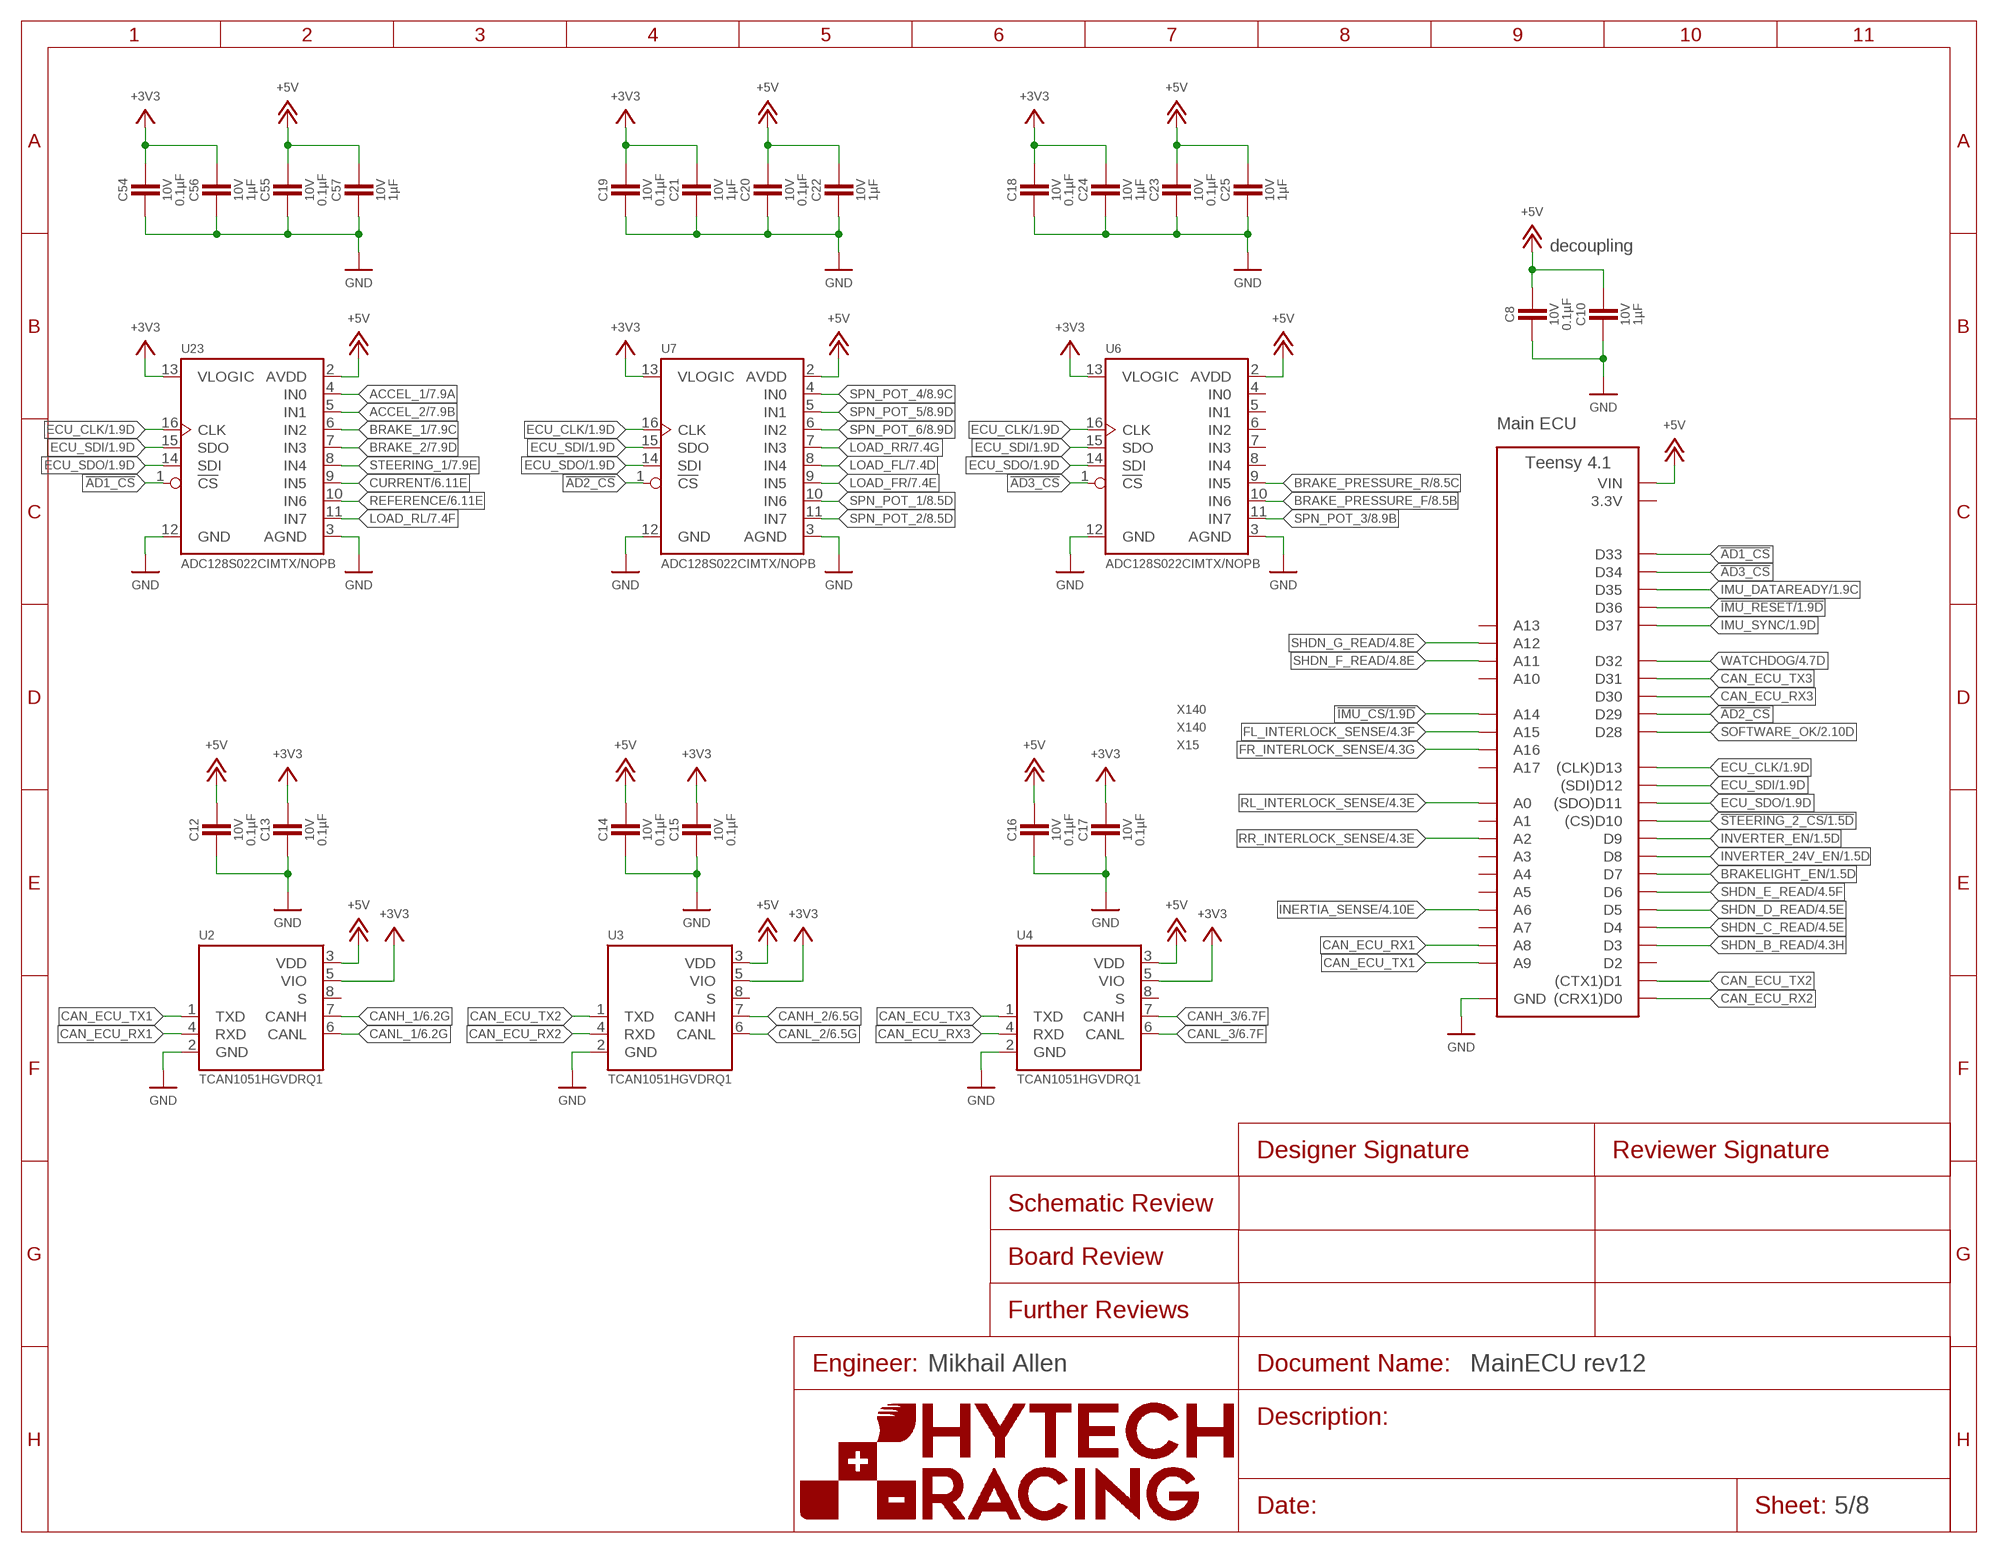
[diagram p4: schematic, sheet 5]
FRAME3 (FRAME): ENGINEER: Mikhail Allen

### Parts
A2  TEENSY_4.1_SMT  [TEENSY_LONG_SSM]
C8  CAPACITOR_0603_10V_0.1UF  [0603-CAP]
C10  CAPACITOR_0603_10V_1UF  [0603-CAP]
C12  CAPACITOR_0603_10V_0.1UF  [0603-CAP]
C13  CAPACITOR_0603_10V_0.1UF  [0603-CAP]
C14  CAPACITOR_0603_10V_0.1UF  [0603-CAP]
C15  CAPACITOR_0603_10V_0.1UF  [0603-CAP]
C16  CAPACITOR_0603_10V_0.1UF  [0603-CAP]
C17  CAPACITOR_0603_10V_0.1UF  [0603-CAP]
C18  CAPACITOR_0603_10V_0.1UF  [0603-CAP]
C19  CAPACITOR_0603_10V_0.1UF  [0603-CAP]
C20  CAPACITOR_0603_10V_0.1UF  [0603-CAP]
C21  CAPACITOR_0603_10V_1UF  [0603-CAP]
C22  CAPACITOR_0603_10V_1UF  [0603-CAP]
C23  CAPACITOR_0603_10V_0.1UF  [0603-CAP]
C24  CAPACITOR_0603_10V_1UF  [0603-CAP]
C25  CAPACITOR_0603_10V_1UF  [0603-CAP]
C54  CAPACITOR_0603_10V_0.1UF  [0603-CAP]
C55  CAPACITOR_0603_10V_0.1UF  [0603-CAP]
C56  CAPACITOR_0603_10V_1UF  [0603-CAP]
C57  CAPACITOR_0603_10V_1UF  [0603-CAP]
U2  TCAN1051HQV-Q1  [SOIC-08(NARROW,0.15")]
U3  TCAN1051HQV-Q1  [SOIC-08(NARROW,0.15")]
U4  TCAN1051HQV-Q1  [SOIC-08(NARROW,0.15")]
U6  ADC128S022  [TSSOP-16]
U7  ADC128S022  [TSSOP-16]
U23  ADC128S022  [TSSOP-16]

### Nets
!AD1_CS: A2.D33 U23.1(!CS!)
!AD2_CS: A2.D29 U7.1(!CS!)
!AD3_CS: A2.D34 U6.1(!CS!)
!IMU_CS: A2.D38(A14) ; also sheet 1
!IMU_RESET: A2.D36 ; also sheet 1
!STEERING_2_CS: A2.D10((CS)D10) ; also sheet 1
+3V3: C13.1 C15.1 C17.1 C18.1 C19.1 C21.1 C24.1 C54.1 C56.1 U2.5(VIO) U3.5(VIO) U4.5(VIO) U6.13(VLOGIC) U7.13(VLOGIC) U23.13(VLOGIC) ; also sheet 1,2,4,6
+5V: A2.VIN C8.1 C10.1 C12.1 C14.1 C16.1 C20.1 C22.1 C23.1 C25.1 C55.1 C57.1 U2.3(VDD) U3.3(VDD) U4.3(VDD) U6.2(AVDD) U7.2(AVDD) U23.2(AVDD) ; also sheet 1,2,3,6,7
ACCEL_1: U23.4(IN0) ; also sheet 7
ACCEL_2: U23.5(IN1) ; also sheet 7
BRAKE_1: U23.6(IN2) ; also sheet 3,7
BRAKE_2: U23.7(IN3) ; also sheet 7
BRAKE_PRESSURE_F: U6.10(IN6) ; also sheet 8
BRAKE_PRESSURE_R: U6.9(IN5) ; also sheet 8
BRAKELIGHT_EN: A2.D7 ; also sheet 1
CAN_ECU_RX1: A2.D22(A8) U2.4(RXD)
CAN_ECU_RX2: A2.D0((CRX1)D0) U3.4(RXD)
CAN_ECU_RX3: A2.D30 U4.4(RXD)
CAN_ECU_TX1: A2.D23(A9) U2.1(TXD)
CAN_ECU_TX2: A2.D1((CTX1)D1) U3.1(TXD)
CAN_ECU_TX3: A2.D31 U4.1(TXD)
CANH_1: U2.7(CANH) ; also sheet 1,2,6
CANH_2: U3.7(CANH) ; also sheet 1,2,6
CANH_3: U4.7(CANH) ; also sheet 1,2,6
CANL_1: U2.6(CANL) ; also sheet 1,2,6
CANL_2: U3.6(CANL) ; also sheet 1,2,6
CANL_3: U4.6(CANL) ; also sheet 1,2,6
CURRENT: U23.9(IN5) ; also sheet 3,6,7
ECU_CLK: A2.D13((CLK)D13) U6.16(CLK) U7.16(CLK) U23.16(CLK) ; also sheet 1
ECU_SDI: A2.D12((SDI)D12) U6.15(SDO) U7.15(SDO) U23.15(SDO) ; also sheet 1
ECU_SDO: A2.D11((SDO)D11) U6.14(SDI) U7.14(SDI) U23.14(SDI) ; also sheet 1
FL_INTERLOCK_SENSE: A2.D39(A15) ; also sheet 4
FR_INTERLOCK_SENSE: A2.D40(A16) ; also sheet 4
GND: A2.AGND/GND(GND) A2.GND A2.GND@1(GND) C8.2 C10.2 C12.2 C13.2 C14.2 C15.2 C16.2 C17.2 C18.2 C19.2 C20.2 C21.2 C22.2 C23.2 C24.2 C25.2 C54.2 C55.2 C56.2 C57.2 U2.2(GND) U3.2(GND) U4.2(GND) U6.3(AGND) U6.12(GND) U7.3(AGND) U7.12(GND) U23.3(AGND) U23.12(GND) ; also sheet 1,2,3,4,6,7,8
IMU_DATAREADY: A2.D35 ; also sheet 1
IMU_SYNC: A2.D37 ; also sheet 1
INERTIA_SENSE: A2.D20(A6) ; also sheet 4
INVERTER_24V_EN: A2.D8 ; also sheet 1
INVERTER_EN: A2.D9 ; also sheet 1
LOAD_FL: U7.8(IN4) ; also sheet 7
LOAD_FR: U7.9(IN5) ; also sheet 7
LOAD_RL: U23.11(IN7) ; also sheet 7
LOAD_RR: U7.7(IN3) ; also sheet 7
REFERENCE: U23.10(IN6) ; also sheet 3,6,7
RL_INTERLOCK_SENSE: A2.D14(A0) ; also sheet 4
RR_INTERLOCK_SENSE: A2.D16(A2) ; also sheet 4
SHDN_B_READ: A2.D3 ; also sheet 4
SHDN_C_READ: A2.D4 ; also sheet 4
SHDN_D_READ: A2.D5 ; also sheet 4
SHDN_E_READ: A2.D6 ; also sheet 4
SHDN_F_READ: A2.D25(A11) ; also sheet 4
SHDN_G_READ: A2.D26(A12) ; also sheet 4
SOFTWARE_OK: A2.D28 ; also sheet 2,4
SPN_POT_1: U7.10(IN6) ; also sheet 8
SPN_POT_2: U7.11(IN7) ; also sheet 8
SPN_POT_3: U6.11(IN7) ; also sheet 8
SPN_POT_4: U7.4(IN0) ; also sheet 8
SPN_POT_5: U7.5(IN1) ; also sheet 8
SPN_POT_6: U7.6(IN2) ; also sheet 8
STEERING_1: U23.8(IN4) ; also sheet 7
WATCHDOG: A2.D32 ; also sheet 4
Unconnected: A2.D2 A2.D15(A1) A2.D17(A3) A2.D18(A4) A2.D19(A5) A2.D21(A7) A2.D24(A10) A2.D27(A13) A2.D41(A17) U2.8(S) U3.8(S) U4.8(S) U6.4(IN0) U6.5(IN1) U6.6(IN2) U6.7(IN3) U6.8(IN4)

### Notes on the sheet
- decoupling
- Main ECU
- X140
- X140
- X15

## Sheet 6 of 8
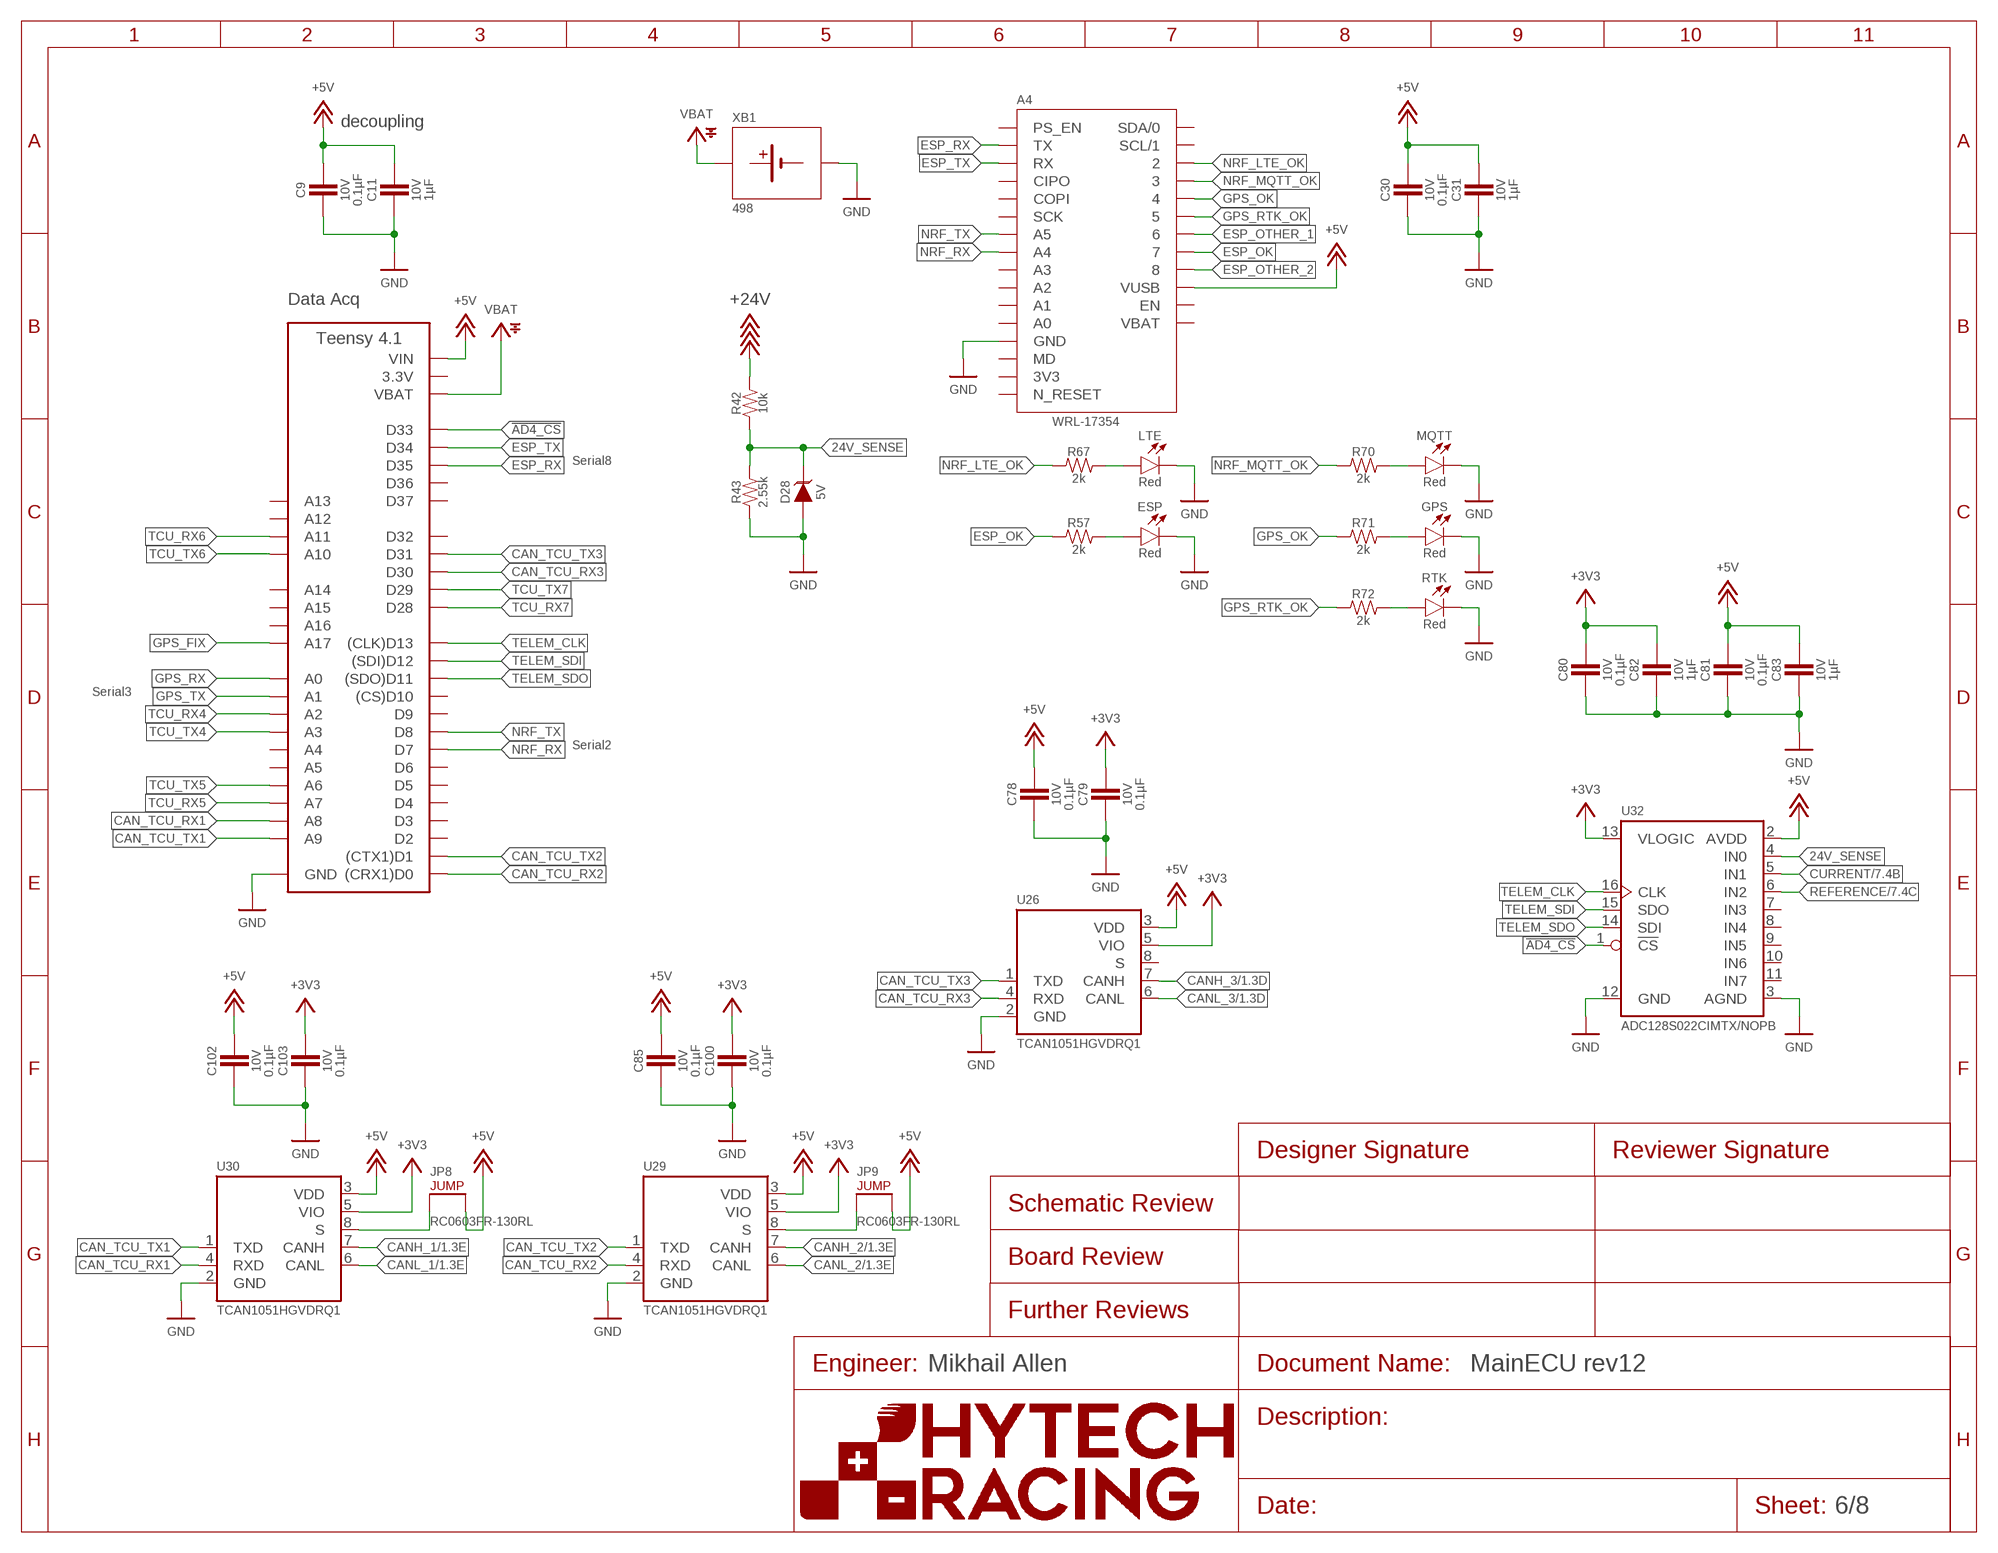
[diagram p5: schematic, sheet 6]
FRAME6 (FRAME): ENGINEER: Mikhail Allen

### Parts
A3  TEENSY_4.1  [TEENSY_LONG_EXT]
A4  NRF9160LTE  [NRF9160LTE]
C9  CAPACITOR_0603_10V_0.1UF  [0603-CAP]
C11  CAPACITOR_0603_10V_1UF  [0603-CAP]
C30  CAPACITOR_0603_10V_0.1UF  [0603-CAP]
C31  CAPACITOR_0603_10V_1UF  [0603-CAP]
C78  CAPACITOR_0603_10V_0.1UF  [0603-CAP]
C79  CAPACITOR_0603_10V_0.1UF  [0603-CAP]
C80  CAPACITOR_0603_10V_0.1UF  [0603-CAP]
C81  CAPACITOR_0603_10V_0.1UF  [0603-CAP]
C82  CAPACITOR_0603_10V_1UF  [0603-CAP]
C83  CAPACITOR_0603_10V_1UF  [0603-CAP]
C85  CAPACITOR_0603_10V_0.1UF  [0603-CAP]
C100  CAPACITOR_0603_10V_0.1UF  [0603-CAP]
C102  CAPACITOR_0603_10V_0.1UF  [0603-CAP]
C103  CAPACITOR_0603_10V_0.1UF  [0603-CAP]
D28  TVS__5V  [SOT-23]
ESP  LED_0603_RED  [0603-LED]
GPS  LED_0603_RED  [0603-LED]
JP8  JUMPER_0603_  [0603-RES]
JP9  JUMPER_0603_  [0603-RES]
LTE  LED_0603_RED  [0603-LED]
MQTT  LED_0603_RED  [0603-LED]
R42  RESISTOR_0603_10K  [0603-RES]
R43  RESISTOR_0603_2.55K  [0603-RES]
R57  RESISTOR_0603_2K  [0603-RES]
R67  RESISTOR_0603_2K  [0603-RES]
R70  RESISTOR_0603_2K  [0603-RES]
R71  RESISTOR_0603_2K  [0603-RES]
R72  RESISTOR_0603_2K  [0603-RES]
RTK  LED_0603_RED  [0603-LED]
U26  TCAN1051HQV-Q1  [SOIC-08(NARROW,0.15")]
U29  TCAN1051HQV-Q1  [SOIC-08(NARROW,0.15")]
U30  TCAN1051HQV-Q1  [SOIC-08(NARROW,0.15")]
U32  ADC128S022  [TSSOP-16]
XB1  BATTERY_HOLDER_KEYSTONE_498  [498]

### Nets
24V_SENSE: D28.3(C) R42.1 R43.2 U32.4(IN0)
!AD4_CS: A3.D33 U32.1(!CS!)
+3V3: C79.1 C80.1 C82.1 C100.1 C103.1 U26.5(VIO) U29.5(VIO) U30.5(VIO) U32.13(VLOGIC) ; also sheet 1,2,4,5
+5V: A3.VIN A4.VUSB C9.1 C11.1 C30.1 C31.1 C78.1 C81.1 C83.1 C85.1 C102.1 JP8.2 JP9.2 U26.3(VDD) U29.3(VDD) U30.3(VDD) U32.2(AVDD) ; also sheet 1,2,3,5,7
+24V: R42.2 ; also sheet 1,2,3,4
CAN_TCU_RX1: A3.D22(A8) U30.4(RXD)
CAN_TCU_RX2: A3.D0((CRX1)D0) U29.4(RXD)
CAN_TCU_RX3: A3.D30 U26.4(RXD)
CAN_TCU_TX1: A3.D23(A9) U30.1(TXD)
CAN_TCU_TX2: A3.D1((CTX1)D1) U29.1(TXD)
CAN_TCU_TX3: A3.D31 U26.1(TXD)
CANH_1: U30.7(CANH) ; also sheet 1,2,5
CANH_2: U29.7(CANH) ; also sheet 1,2,5
CANH_3: U26.7(CANH) ; also sheet 1,2,5
CANL_1: U30.6(CANL) ; also sheet 1,2,5
CANL_2: U29.6(CANL) ; also sheet 1,2,5
CANL_3: U26.6(CANL) ; also sheet 1,2,5
CURRENT: U32.5(IN1) ; also sheet 3,5,7
ESP_OK: A4.7 R57.1
ESP_OTHER_1: A4.6
ESP_OTHER_2: A4.8
ESP_RX: A3.D35 A4.TX
ESP_TX: A3.D34 A4.RX
GND: A3.AGND/GND(GND) A3.GND A3.GND@2(GND) A4.GND C9.2 C11.2 C30.2 C31.2 C78.2 C79.2 C80.2 C81.2 C82.2 C83.2 C85.2 C100.2 C102.2 C103.2 D28.1(A) ESP.1(C) GPS.1(C) LTE.1(C) MQTT.1(C) R43.1 RTK.1(C) U26.2(GND) U29.2(GND) U30.2(GND) U32.3(AGND) U32.12(GND) XB1.2(MINUS) ; also sheet 1,2,3,4,5,7,8
GPS_FIX: A3.D41(A17)
GPS_OK: A4.4 R71.1
GPS_RTK_OK: A4.5 R72.1
GPS_RX: A3.D14(A0)
GPS_TX: A3.D15(A1)
N$3: JP8.1 U30.8(S)
N$11: JP9.1 U29.8(S)
N$32: ESP.2(A) R57.2
N$35: LTE.2(A) R67.2
N$36: MQTT.2(A) R70.2
N$37: GPS.2(A) R71.2
N$38: R72.2 RTK.2(A)
NRF_LTE_OK: A4.2 R67.1
NRF_MQTT_OK: A4.3 R70.1
NRF_RX: A3.D7 A4.A4
NRF_TX: A3.D8 A4.A5
REFERENCE: U32.6(IN2) ; also sheet 3,5,7
TCU_RX4: A3.D16(A2)
TCU_RX5: A3.D21(A7)
TCU_RX6: A3.D25(A11)
TCU_RX7: A3.D28
TCU_TX4: A3.D17(A3)
TCU_TX5: A3.D20(A6)
TCU_TX6: A3.D24(A10)
TCU_TX7: A3.D29
TELEM_CLK: A3.D13((CLK)D13) U32.16(CLK)
TELEM_SDI: A3.D12((SDI)D12) U32.15(SDO)
TELEM_SDO: A3.D11((SDO)D11) U32.14(SDI)
VBAT: A3.VBAT XB1.1(PLUS)
Unconnected: A3.D2 A3.D3 A3.D4 A3.D5 A3.D6 A3.D9 A3.D10((CS)D10) A3.D18(A4) A3.D19(A5) A3.D26(A12) A3.D27(A13) A3.D32 A3.D36 A3.D37 A3.D38(A14) A3.D39(A15) A3.D40(A16) A4.A0 A4.A1 A4.A2 A4.A3 A4.CIPO A4.COPI A4.EN A4.MD A4.PS-EN(PS_EN) A4.RESET(N_RESET) A4.SCK A4.SCL/1 A4.SDA/0 U26.8(S) U32.7(IN3) U32.8(IN4) U32.9(IN5) U32.10(IN6) U32.11(IN7)

### Notes on the sheet
- decoupling
- Data Acq
- Serial8
- Serial3
- Serial2

## Sheet 7 of 8
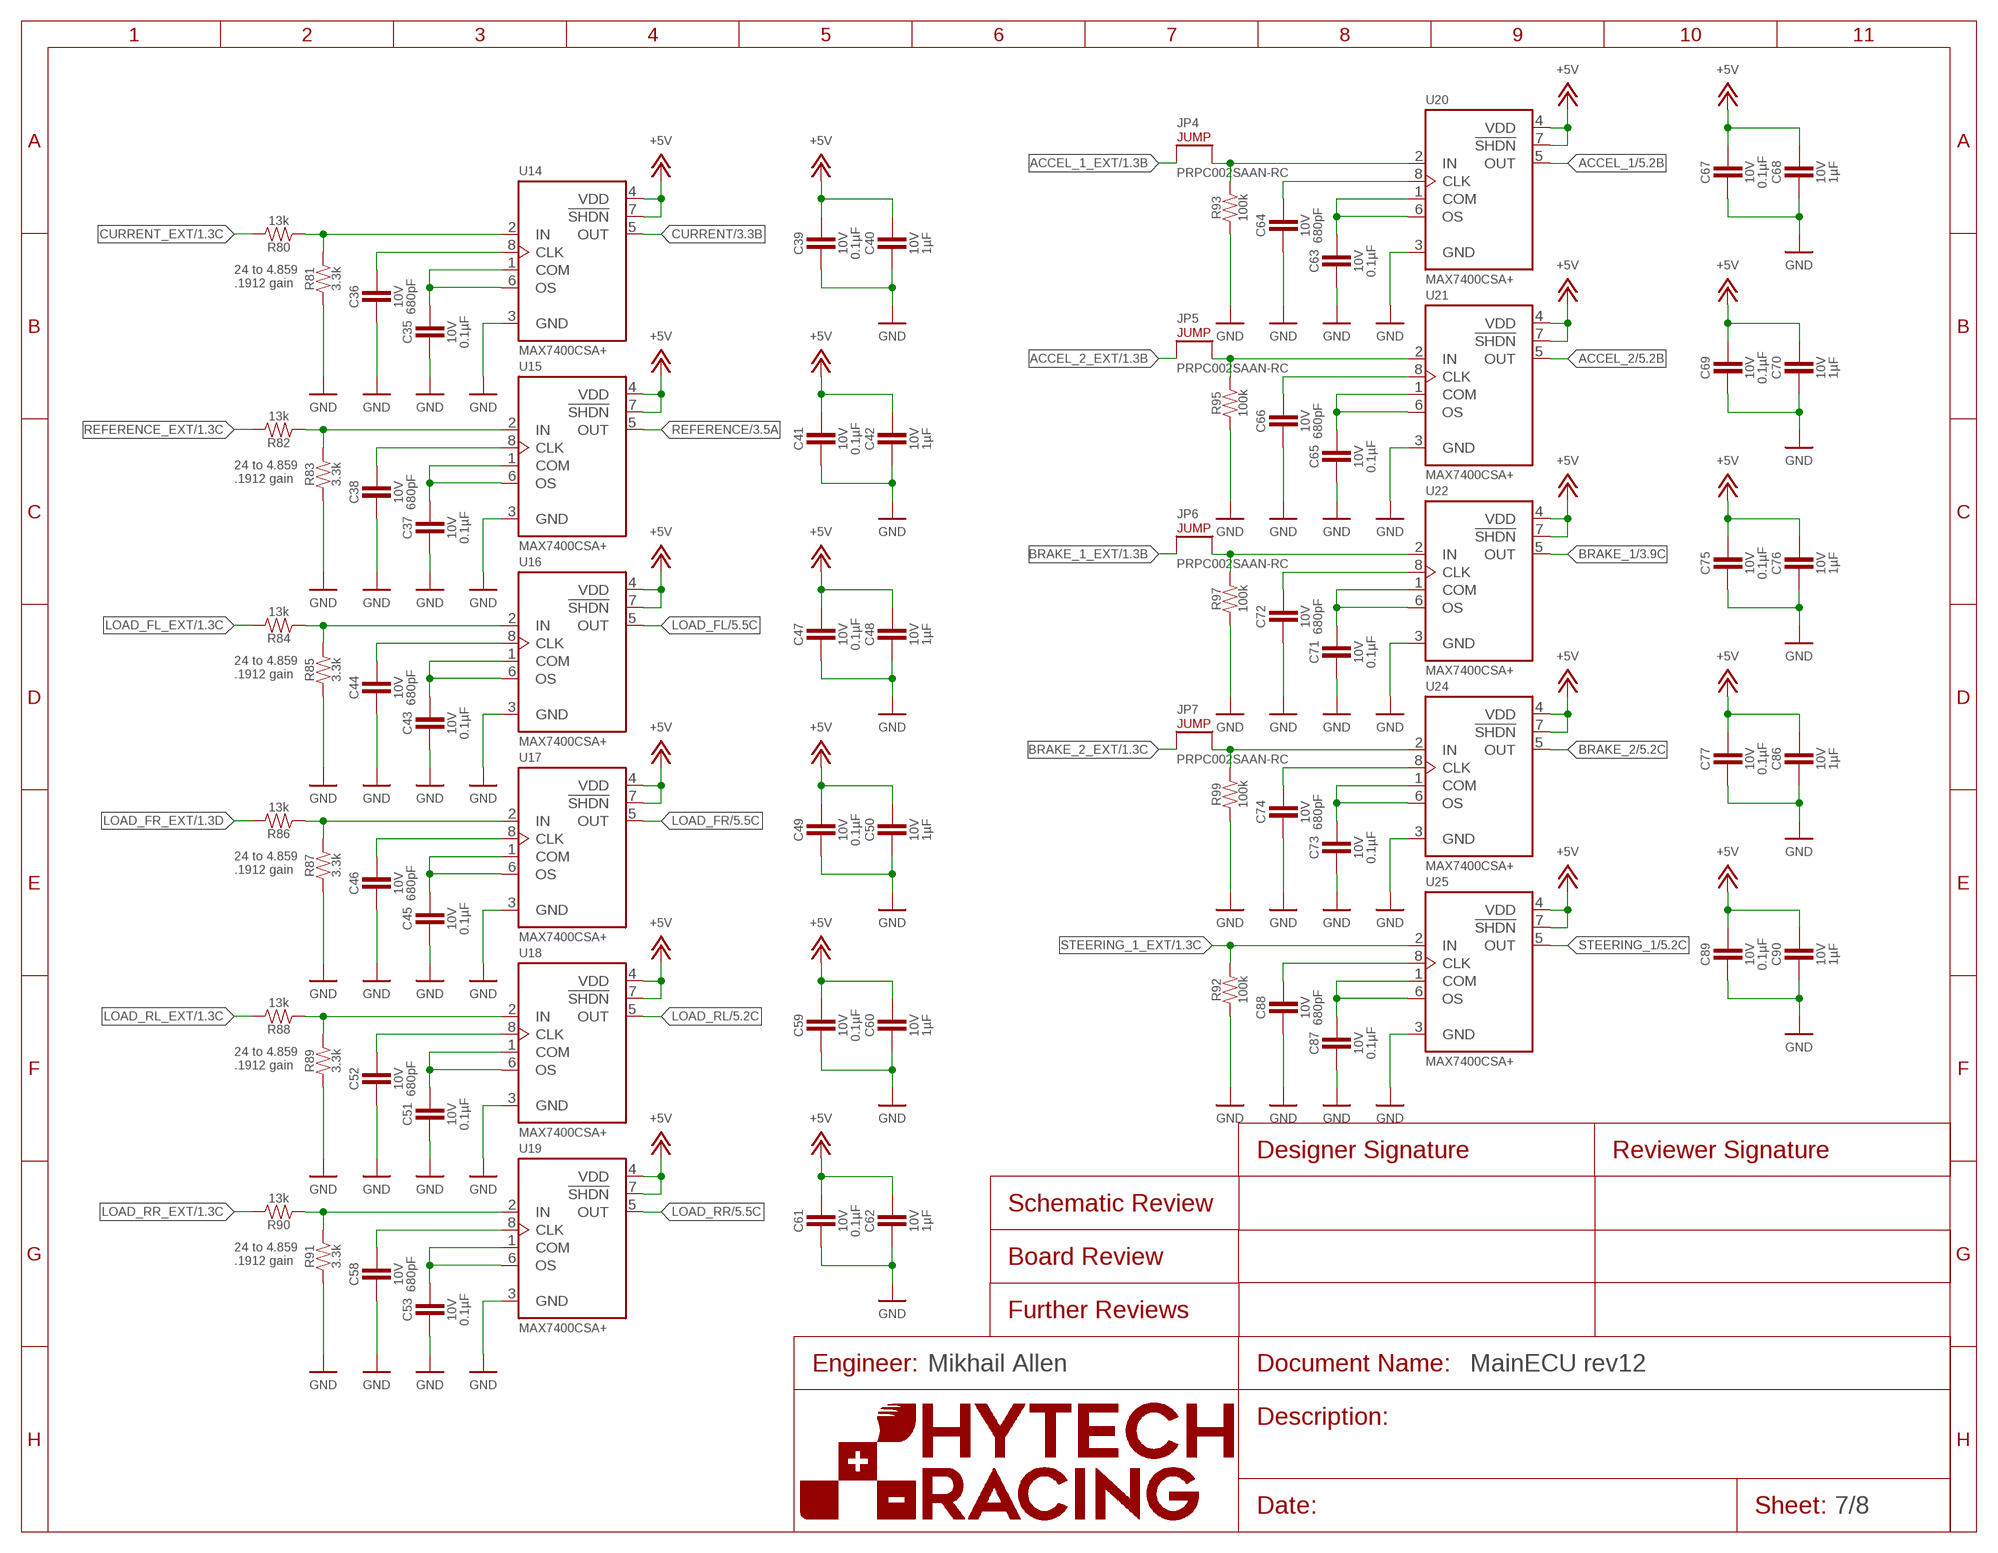
[diagram p6: schematic, sheet 7]
FRAME4 (FRAME): ENGINEER: Mikhail Allen

### Parts
C35  CAPACITOR_0603_10V_0.1UF  [0603-CAP]
C36  CAPACITOR_0603_10V_680PF  [0603-CAP]
C37  CAPACITOR_0603_10V_0.1UF  [0603-CAP]
C38  CAPACITOR_0603_10V_680PF  [0603-CAP]
C39  CAPACITOR_0603_10V_0.1UF  [0603-CAP]
C40  CAPACITOR_0603_10V_1UF  [0603-CAP]
C41  CAPACITOR_0603_10V_0.1UF  [0603-CAP]
C42  CAPACITOR_0603_10V_1UF  [0603-CAP]
C43  CAPACITOR_0603_10V_0.1UF  [0603-CAP]
C44  CAPACITOR_0603_10V_680PF  [0603-CAP]
C45  CAPACITOR_0603_10V_0.1UF  [0603-CAP]
C46  CAPACITOR_0603_10V_680PF  [0603-CAP]
C47  CAPACITOR_0603_10V_0.1UF  [0603-CAP]
C48  CAPACITOR_0603_10V_1UF  [0603-CAP]
C49  CAPACITOR_0603_10V_0.1UF  [0603-CAP]
C50  CAPACITOR_0603_10V_1UF  [0603-CAP]
C51  CAPACITOR_0603_10V_0.1UF  [0603-CAP]
C52  CAPACITOR_0603_10V_680PF  [0603-CAP]
C53  CAPACITOR_0603_10V_0.1UF  [0603-CAP]
C58  CAPACITOR_0603_10V_680PF  [0603-CAP]
C59  CAPACITOR_0603_10V_0.1UF  [0603-CAP]
C60  CAPACITOR_0603_10V_1UF  [0603-CAP]
C61  CAPACITOR_0603_10V_0.1UF  [0603-CAP]
C62  CAPACITOR_0603_10V_1UF  [0603-CAP]
C63  CAPACITOR_0603_10V_0.1UF  [0603-CAP]
C64  CAPACITOR_0603_10V_680PF  [0603-CAP]
C65  CAPACITOR_0603_10V_0.1UF  [0603-CAP]
C66  CAPACITOR_0603_10V_680PF  [0603-CAP]
C67  CAPACITOR_0603_10V_0.1UF  [0603-CAP]
C68  CAPACITOR_0603_10V_1UF  [0603-CAP]
C69  CAPACITOR_0603_10V_0.1UF  [0603-CAP]
C70  CAPACITOR_0603_10V_1UF  [0603-CAP]
C71  CAPACITOR_0603_10V_0.1UF  [0603-CAP]
C72  CAPACITOR_0603_10V_680PF  [0603-CAP]
C73  CAPACITOR_0603_10V_0.1UF  [0603-CAP]
C74  CAPACITOR_0603_10V_680PF  [0603-CAP]
C75  CAPACITOR_0603_10V_0.1UF  [0603-CAP]
C76  CAPACITOR_0603_10V_1UF  [0603-CAP]
C77  CAPACITOR_0603_10V_0.1UF  [0603-CAP]
C86  CAPACITOR_0603_10V_1UF  [0603-CAP]
C87  CAPACITOR_0603_10V_0.1UF  [0603-CAP]
C88  CAPACITOR_0603_10V_680PF  [0603-CAP]
C89  CAPACITOR_0603_10V_0.1UF  [0603-CAP]
C90  CAPACITOR_0603_10V_1UF  [0603-CAP]
JP4  JUMPER__1X02  [1X02]
JP5  JUMPER__1X02  [1X02]
JP6  JUMPER__1X02  [1X02]
JP7  JUMPER__1X02  [1X02]
R80  RESISTOR_0603_13K  [0603-RES]
R81  RESISTOR_0603_3.3K  [0603-RES]
R82  RESISTOR_0603_13K  [0603-RES]
R83  RESISTOR_0603_3.3K  [0603-RES]
R84  RESISTOR_0603_13K  [0603-RES]
R85  RESISTOR_0603_3.3K  [0603-RES]
R86  RESISTOR_0603_13K  [0603-RES]
R87  RESISTOR_0603_3.3K  [0603-RES]
R88  RESISTOR_0603_13K  [0603-RES]
R89  RESISTOR_0603_3.3K  [0603-RES]
R90  RESISTOR_0603_13K  [0603-RES]
R91  RESISTOR_0603_3.3K  [0603-RES]
R92  RESISTOR_0603_100K  [0603-RES]
R93  RESISTOR_0603_100K  [0603-RES]
R95  RESISTOR_0603_100K  [0603-RES]
R97  RESISTOR_0603_100K  [0603-RES]
R99  RESISTOR_0603_100K  [0603-RES]
U14  MAX7400  [SOIC-08(NARROW,0.15")]
U15  MAX7400  [SOIC-08(NARROW,0.15")]
U16  MAX7400  [SOIC-08(NARROW,0.15")]
U17  MAX7400  [SOIC-08(NARROW,0.15")]
U18  MAX7400  [SOIC-08(NARROW,0.15")]
U19  MAX7400  [SOIC-08(NARROW,0.15")]
U20  MAX7400  [SOIC-08(NARROW,0.15")]
U21  MAX7400  [SOIC-08(NARROW,0.15")]
U22  MAX7400  [SOIC-08(NARROW,0.15")]
U24  MAX7400  [SOIC-08(NARROW,0.15")]
U25  MAX7400  [SOIC-08(NARROW,0.15")]

### Nets
+5V: C39.1 C40.1 C41.1 C42.1 C47.1 C48.1 C49.1 C50.1 C59.1 C60.1 C61.1 C62.1 C67.1 C68.1 C69.1 C70.1 C75.1 C76.1 C77.1 C86.1 C89.1 C90.1 U14.4(VDD) U14.7(!SHDN) U15.4(VDD) U15.7(!SHDN) U16.4(VDD) U16.7(!SHDN) U17.4(VDD) U17.7(!SHDN) U18.4(VDD) U18.7(!SHDN) U19.4(VDD) U19.7(!SHDN) U20.4(VDD) U20.7(!SHDN) U21.4(VDD) U21.7(!SHDN) U22.4(VDD) U22.7(!SHDN) U24.4(VDD) U24.7(!SHDN) U25.4(VDD) U25.7(!SHDN) ; also sheet 1,2,3,5,6
ACCEL_1: U20.5(OUT) ; also sheet 5
ACCEL_1_EXT: JP4.1 ; also sheet 1
ACCEL_1_PRE: JP4.2 R93.2 U20.2(IN)
ACCEL_2: U21.5(OUT) ; also sheet 5
ACCEL_2_EXT: JP5.1 ; also sheet 1
ACCEL_2_PRE: JP5.2 R95.2 U21.2(IN)
BRAKE_1: U22.5(OUT) ; also sheet 3,5
BRAKE_1_EXT: JP6.1 ; also sheet 1
BRAKE_1_PRE: JP6.2 R97.2 U22.2(IN)
BRAKE_2: U24.5(OUT) ; also sheet 5
BRAKE_2_EXT: JP7.1 ; also sheet 1
BRAKE_2_PRE: JP7.2 R99.2 U24.2(IN)
CURRENT: U14.5(OUT) ; also sheet 3,5,6
CURRENT_EXT: R80.2 ; also sheet 1
GND: C35.2 C36.2 C37.2 C38.2 C39.2 C40.2 C41.2 C42.2 C43.2 C44.2 C45.2 C46.2 C47.2 C48.2 C49.2 C50.2 C51.2 C52.2 C53.2 C58.2 C59.2 C60.2 C61.2 C62.2 C63.2 C64.2 C65.2 C66.2 C67.2 C68.2 C69.2 C70.2 C71.2 C72.2 C73.2 C74.2 C75.2 C76.2 C77.2 C86.2 C87.2 C88.2 C89.2 C90.2 R81.1 R83.1 R85.1 R87.1 R89.1 R91.1 R92.1 R93.1 R95.1 R97.1 R99.1 U14.3(GND) U15.3(GND) U16.3(GND) U17.3(GND) U18.3(GND) U19.3(GND) U20.3(GND) U21.3(GND) U22.3(GND) U24.3(GND) U25.3(GND) ; also sheet 1,2,3,4,5,6,8
LOAD_FL: U16.5(OUT) ; also sheet 5
LOAD_FL_EXT: R84.2 ; also sheet 1
LOAD_FR: U17.5(OUT) ; also sheet 5
LOAD_FR_EXT: R86.2 ; also sheet 1
LOAD_RL: U18.5(OUT) ; also sheet 5
LOAD_RL_EXT: R88.2 ; also sheet 1
LOAD_RR: U19.5(OUT) ; also sheet 5
LOAD_RR_EXT: R90.2 ; also sheet 1
N$49: R80.1 R81.2 U14.2(IN)
N$50: C35.1 U14.1(COM) U14.6(OS)
N$51: C36.1 U14.8(CLK)
N$53: R82.1 R83.2 U15.2(IN)
N$54: C37.1 U15.1(COM) U15.6(OS)
N$55: C38.1 U15.8(CLK)
N$57: R84.1 R85.2 U16.2(IN)
N$63: C43.1 U16.1(COM) U16.6(OS)
N$64: C44.1 U16.8(CLK)
N$66: R86.1 R87.2 U17.2(IN)
N$69: C45.1 U17.1(COM) U17.6(OS)
N$70: C46.1 U17.8(CLK)
N$71: R88.1 R89.2 U18.2(IN)
N$72: C51.1 U18.1(COM) U18.6(OS)
N$77: C52.1 U18.8(CLK)
N$78: R90.1 R91.2 U19.2(IN)
N$79: C53.1 U19.1(COM) U19.6(OS)
N$80: C58.1 U19.8(CLK)
N$81: C87.1 U25.1(COM) U25.6(OS)
N$82: C63.1 U20.1(COM) U20.6(OS)
N$83: C64.1 U20.8(CLK)
N$84: C88.1 U25.8(CLK)
N$85: C65.1 U21.1(COM) U21.6(OS)
N$86: C66.1 U21.8(CLK)
N$88: C71.1 U22.1(COM) U22.6(OS)
N$89: C72.1 U22.8(CLK)
N$91: C73.1 U24.1(COM) U24.6(OS)
N$92: C74.1 U24.8(CLK)
REFERENCE: U15.5(OUT) ; also sheet 3,5,6
REFERENCE_EXT: R82.2 ; also sheet 1
STEERING_1: U25.5(OUT) ; also sheet 5
STEERING_1_EXT: R92.2 U25.2(IN) ; also sheet 1

### Notes on the sheet
- 24 to 4.859
  .1912 gain
- 24 to 4.859
  .1912 gain
- 24 to 4.859
  .1912 gain
- 24 to 4.859
  .1912 gain
- 24 to 4.859
  .1912 gain
- 24 to 4.859
  .1912 gain

## Sheet 8 of 8
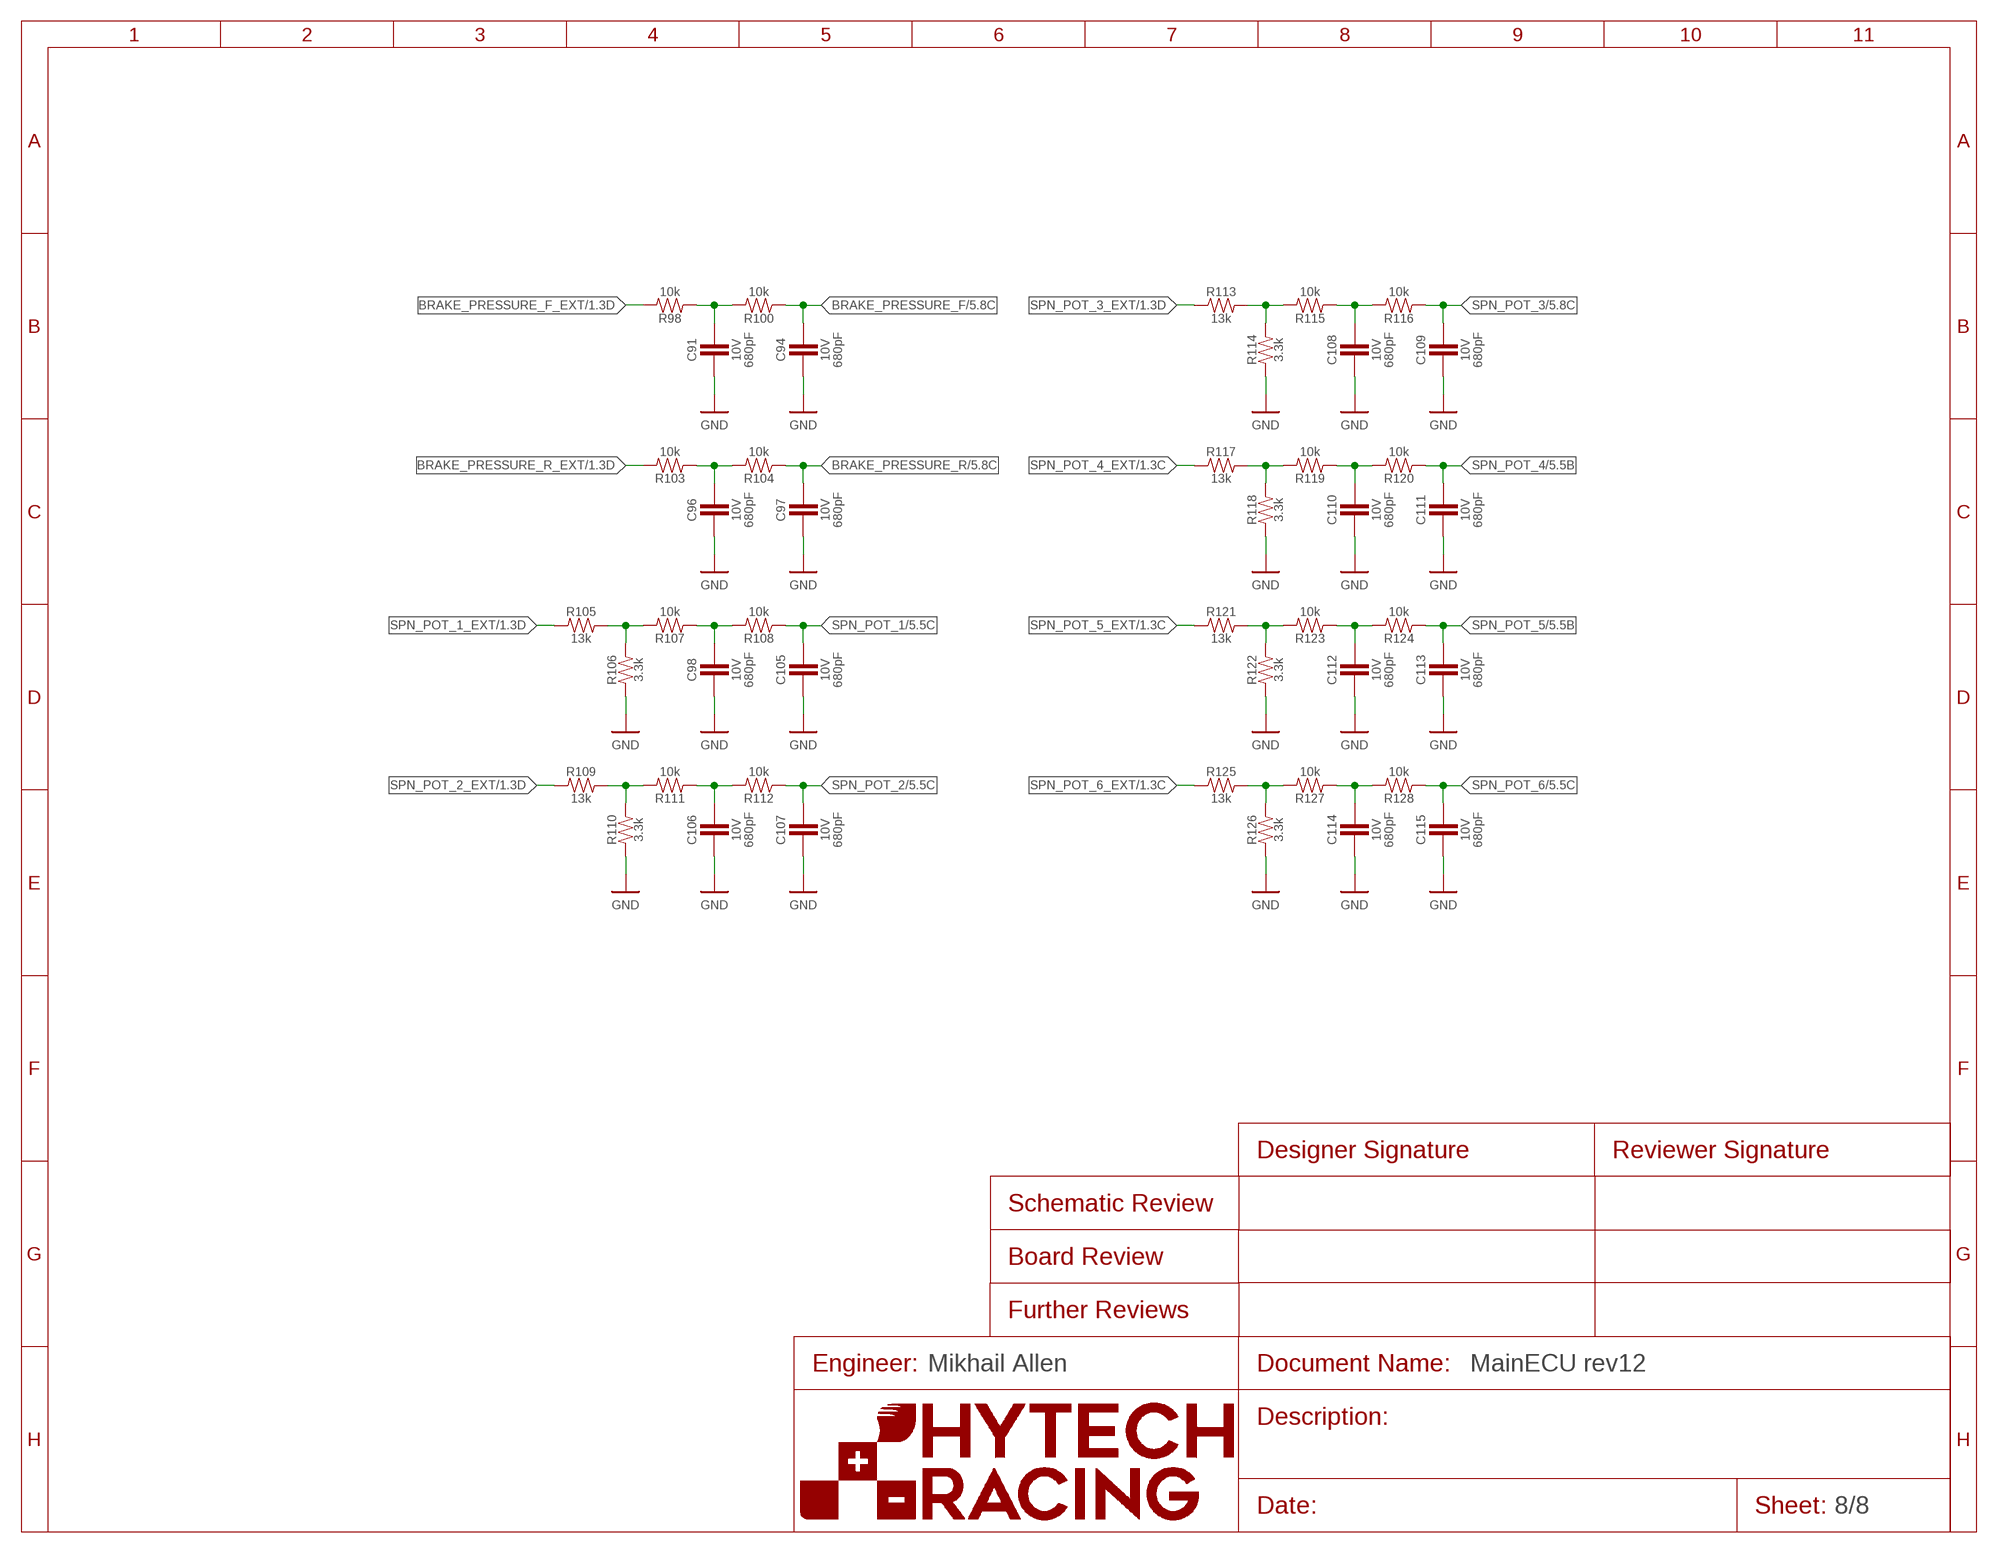
[diagram p7: schematic, sheet 8]
FRAME5 (FRAME): ENGINEER: Mikhail Allen

### Parts
C91  CAPACITOR_0603_10V_680PF  [0603-CAP]
C94  CAPACITOR_0603_10V_680PF  [0603-CAP]
C96  CAPACITOR_0603_10V_680PF  [0603-CAP]
C97  CAPACITOR_0603_10V_680PF  [0603-CAP]
C98  CAPACITOR_0603_10V_680PF  [0603-CAP]
C105  CAPACITOR_0603_10V_680PF  [0603-CAP]
C106  CAPACITOR_0603_10V_680PF  [0603-CAP]
C107  CAPACITOR_0603_10V_680PF  [0603-CAP]
C108  CAPACITOR_0603_10V_680PF  [0603-CAP]
C109  CAPACITOR_0603_10V_680PF  [0603-CAP]
C110  CAPACITOR_0603_10V_680PF  [0603-CAP]
C111  CAPACITOR_0603_10V_680PF  [0603-CAP]
C112  CAPACITOR_0603_10V_680PF  [0603-CAP]
C113  CAPACITOR_0603_10V_680PF  [0603-CAP]
C114  CAPACITOR_0603_10V_680PF  [0603-CAP]
C115  CAPACITOR_0603_10V_680PF  [0603-CAP]
R98  RESISTOR_0603_10K  [0603-RES]
R100  RESISTOR_0603_10K  [0603-RES]
R103  RESISTOR_0603_10K  [0603-RES]
R104  RESISTOR_0603_10K  [0603-RES]
R105  RESISTOR_0603_13K  [0603-RES]
R106  RESISTOR_0603_3.3K  [0603-RES]
R107  RESISTOR_0603_10K  [0603-RES]
R108  RESISTOR_0603_10K  [0603-RES]
R109  RESISTOR_0603_13K  [0603-RES]
R110  RESISTOR_0603_3.3K  [0603-RES]
R111  RESISTOR_0603_10K  [0603-RES]
R112  RESISTOR_0603_10K  [0603-RES]
R113  RESISTOR_0603_13K  [0603-RES]
R114  RESISTOR_0603_3.3K  [0603-RES]
R115  RESISTOR_0603_10K  [0603-RES]
R116  RESISTOR_0603_10K  [0603-RES]
R117  RESISTOR_0603_13K  [0603-RES]
R118  RESISTOR_0603_3.3K  [0603-RES]
R119  RESISTOR_0603_10K  [0603-RES]
R120  RESISTOR_0603_10K  [0603-RES]
R121  RESISTOR_0603_13K  [0603-RES]
R122  RESISTOR_0603_3.3K  [0603-RES]
R123  RESISTOR_0603_10K  [0603-RES]
R124  RESISTOR_0603_10K  [0603-RES]
R125  RESISTOR_0603_13K  [0603-RES]
R126  RESISTOR_0603_3.3K  [0603-RES]
R127  RESISTOR_0603_10K  [0603-RES]
R128  RESISTOR_0603_10K  [0603-RES]

### Nets
BRAKE_PRESSURE_F: C94.1 R100.1 ; also sheet 5
BRAKE_PRESSURE_F_EXT: R98.2 ; also sheet 1
BRAKE_PRESSURE_R: C97.1 R104.1 ; also sheet 5
BRAKE_PRESSURE_R_EXT: R103.2 ; also sheet 1
GND: C91.2 C94.2 C96.2 C97.2 C98.2 C105.2 C106.2 C107.2 C108.2 C109.2 C110.2 C111.2 C112.2 C113.2 C114.2 C115.2 R106.1 R110.1 R114.1 R118.1 R122.1 R126.1 ; also sheet 1,2,3,4,5,6,7
N$93: C91.1 R98.1 R100.2
N$94: C96.1 R103.1 R104.2
N$95: R105.2 R106.2 R107.2
N$96: C98.1 R107.1 R108.2
N$97: R109.2 R110.2 R111.2
N$98: C106.1 R111.1 R112.2
N$99: R113.2 R114.2 R115.2
N$100: C108.1 R115.1 R116.2
N$101: R117.2 R118.2 R119.2
N$102: C110.1 R119.1 R120.2
N$103: R121.2 R122.2 R123.2
N$104: C112.1 R123.1 R124.2
N$105: R125.2 R126.2 R127.2
N$106: C114.1 R127.1 R128.2
SPN_POT_1: C105.1 R108.1 ; also sheet 5
SPN_POT_1_EXT: R105.1 ; also sheet 1
SPN_POT_2: C107.1 R112.1 ; also sheet 5
SPN_POT_2_EXT: R109.1 ; also sheet 1
SPN_POT_3: C109.1 R116.1 ; also sheet 5
SPN_POT_3_EXT: R113.1 ; also sheet 1
SPN_POT_4: C111.1 R120.1 ; also sheet 5
SPN_POT_4_EXT: R117.1 ; also sheet 1
SPN_POT_5: C113.1 R124.1 ; also sheet 5
SPN_POT_5_EXT: R121.1 ; also sheet 1
SPN_POT_6: C115.1 R128.1 ; also sheet 5
SPN_POT_6_EXT: R125.1 ; also sheet 1

## Power pins joined to a net without a drawn wire
3.3V: A2.3.3V A2.3.3V@1(3.3V) A3.3V3(3.3V) A3.3V3@2(3.3V) A3.3V3@3(3.3V)
3V3: A4.3V3
VBAT: A4.VBAT

## Library data of the parts
3V3 5V0 = HyTechDevices:LED_?_*: LED 0603 Blue <https://www.mouser.com/datasheet/2/216/APT1608VBC_D-246010.pdf> Green <https://www.mouser.com/datasheet/2/216/APT1608ZGCK-1173388.pdf> Orange <https://www.mouser.com/datasheet/2/216/APT1608SECK-6197.pdf> Red <https://www.mouser.com/datasheet/2/216/APT1608SECK-J3-PRV-1173336.pdf> White <https://www.mouser.com/datasheet/2/50/SM0603UWC-880813.pdf> Yellow <https://www.mouser.com/datasheet/2/216/APT1608SYCK-J3-PRV-1173311.pdf> 2835 (Series not on Digikey) Lumiled LUXEON 2835 Color Line <https://www.mouser.com/datasheet/2/602/DS236_luxeon_2835_color_line_datasheet-1596094.pdf>; COLOR: Yellow; DKPN: 754-1788-1-ND; MANUFACTURER: Kingbright; MOPN: 604-APT1608SYCK/J3-PRV; MPN: APT1608SYCK/J3-PRV
A1 = HyTechDevices:VOLTAGE_REGULATOR_MODULE_?_*: Voltage Regulator Modules OKI-78SR Datasheet <https://www.mouser.com/datasheet/2/281/oki-78sr-56393.pdf>; DKPN: 811-2196-5-ND; MANUFACTURER: Murata Power Solutions Inc.; MOPN: 580-OKI78SR5/1.5W36C; MPN: OKI-78SR-5/1.5-W36-C
A2 = HyTechDevices:TEENSY_4.1_SMT: Teensy 4.1 without VBAT Datasheet <https://www.pjrc.com/store/teensy41.html#pins> Requires ordering of: 2: 24 pin, 0.1" pitch SMT female headers; TEENSY: 4.1
A3 = HyTechDevices:TEENSY_4.1: Teensy 4.1 with VBAT Datasheet <https://www.pjrc.com/store/teensy41.html#pins> Requires ordering of: 2: 24 pin, 0.1" pitch female headers 1: 2 pin, 0.1" pitch female headers; TEENSY: 4.1
A4 = HyTechDevices:NRF9160LTE: SparkFun Thing Plus - nRF9160 LTE module Datasheet <https://cdn.sparkfun.com/assets/learn_tutorials/1/5/9/7/nRF9160_PS_v1.2.pdf> Sparkfun link <https://www.sparkfun.com/products/17354>; DKPN: 1568-WRL-17354-ND; MANUFACTURER: SparkFun Electronics; MOPN: 474-WRL-17354; MPN: WRL-17354
B BSPD C D E F G = HyTechDevices:LED_?_*: LED 0603 Blue <https://www.mouser.com/datasheet/2/216/APT1608VBC_D-246010.pdf> Green <https://www.mouser.com/datasheet/2/216/APT1608ZGCK-1173388.pdf> Orange <https://www.mouser.com/datasheet/2/216/APT1608SECK-6197.pdf> Red <https://www.mouser.com/datasheet/2/216/APT1608SECK-J3-PRV-1173336.pdf> White <https://www.mouser.com/datasheet/2/50/SM0603UWC-880813.pdf> Yellow <https://www.mouser.com/datasheet/2/216/APT1608SYCK-J3-PRV-1173311.pdf> 2835 (Series not on Digikey) Lumiled LUXEON 2835 Color Line <https://www.mouser.com/datasheet/2/602/DS236_luxeon_2835_color_line_datasheet-1596094.pdf>; COLOR: Green; DKPN: 754-1790-1-ND; MANUFACTURER: Kingbright; MOPN: 604-APT1608ZGCK; MPN: APT1608ZGCK
B_HI B_MIS C_HI C_MIS ESP GPS LTE MQTT RTK = HyTechDevices:LED_?_*: LED 0603 Blue <https://www.mouser.com/datasheet/2/216/APT1608VBC_D-246010.pdf> Green <https://www.mouser.com/datasheet/2/216/APT1608ZGCK-1173388.pdf> Orange <https://www.mouser.com/datasheet/2/216/APT1608SECK-6197.pdf> Red <https://www.mouser.com/datasheet/2/216/APT1608SECK-J3-PRV-1173336.pdf> White <https://www.mouser.com/datasheet/2/50/SM0603UWC-880813.pdf> Yellow <https://www.mouser.com/datasheet/2/216/APT1608SYCK-J3-PRV-1173311.pdf> 2835 (Series not on Digikey) Lumiled LUXEON 2835 Color Line <https://www.mouser.com/datasheet/2/602/DS236_luxeon_2835_color_line_datasheet-1596094.pdf>; COLOR: Red; DKPN: 754-1786-1-ND; MANUFACTURER: Kingbright; MOPN: 604-APT1608SECKJ3PRV; MPN: APT1608SECK/J3-PRV
BMS IMD SWOK WDOG = HyTechDevices:LED_?_*: LED 0603 Blue <https://www.mouser.com/datasheet/2/216/APT1608VBC_D-246010.pdf> Green <https://www.mouser.com/datasheet/2/216/APT1608ZGCK-1173388.pdf> Orange <https://www.mouser.com/datasheet/2/216/APT1608SECK-6197.pdf> Red <https://www.mouser.com/datasheet/2/216/APT1608SECK-J3-PRV-1173336.pdf> White <https://www.mouser.com/datasheet/2/50/SM0603UWC-880813.pdf> Yellow <https://www.mouser.com/datasheet/2/216/APT1608SYCK-J3-PRV-1173311.pdf> 2835 (Series not on Digikey) Lumiled LUXEON 2835 Color Line <https://www.mouser.com/datasheet/2/602/DS236_luxeon_2835_color_line_datasheet-1596094.pdf>; COLOR: Orange; DKPN: 754-1120-1-ND; MANUFACTURER: Kingbright; MOPN: 604-APT1608SECK; MPN: APT1608SECK
C1 = HyTechDevices:CAPACITOR_?_*: Capacitor, Non-Polarized VJ...1BC Series Datasheet <https://www.mouser.com/datasheet/2/427/vjw1bcbascomseries-1762447.pdf> Samsung Datasheet <https://www.mouser.com/datasheet/2/585/MLCC-1837944.pdf> Walsin Datasheet <https://www.mouser.com/datasheet/2/210/WTC_MLCC_General_Purpose-1534899.pdf> GRM188R61A226ME15D <https://www.mouser.com/datasheet/2/281/1/GRM188R61A226ME15_02A-1985787.pdf> GRM188R61E106MA73D <https://www.mouser.com/datasheet/2/281/1/GRM188R61E106MA73_01A-1985806.pdf> 885012006013 <https://www.mouser.com/datasheet/2/445/885012006013-1726946.pdf> 2220Y6300105KXTWS2 <https://www.mouser.com/datasheet/2/218/SMD_High_and_Std_StackiCap_P62-1825512.pdf> Yageo Class 2, X5R <https://www.mouser.com/datasheet/2/447/UPY_GPHC_X5R_4V_to_50V_26-1827097.pdf> TDK C Series <https://www.mouser.com/ProductDetail/TDK/C3216X5R1V226M160AC?qs=%2Fha2pyFadujbcx9jh7lYl%2F4NeMoXFhdc8AqVWNq4wW6M2y7zl6GzBuhgtI0ngznN> AVX Automotive MLCC <https://www.mouser.com/datasheet/2/40/AutoMLCC-777028.pdf> KEMET X7R Series <https://www.mouser.com/datasheet/2/212/KEM_C1002_X7R_SMD-1102033.pdf> Kyocera AVX <https://www.mouser.com/datasheet/2/40/C0GNP0_Dielectric-951274.pdf> GRM21BR61H <https://www.mouser.com/datasheet/2/281/1/GRM21BR61H106KE43_01A-1986884.pdf> C1812W104KDRACTU <https://www.mouser.com/datasheet/2/212/KEM_C1034_X7R_HV_ARC_SMD-1101730.pdf>; CAPACITANCE: 10uF; DKPN: 490-18663-2-ND; MANUFACTURER: Murata; MOPN: 81-GRM21BR61H106KE3L; MPN: GRM21BR61H106KE43L; TOLERANCE: 10%; VOLTAGE: 50V
C2-C4 C27 = HyTechDevices:CAPACITOR_?_*: Capacitor, Non-Polarized VJ...1BC Series Datasheet <https://www.mouser.com/datasheet/2/427/vjw1bcbascomseries-1762447.pdf> Samsung Datasheet <https://www.mouser.com/datasheet/2/585/MLCC-1837944.pdf> Walsin Datasheet <https://www.mouser.com/datasheet/2/210/WTC_MLCC_General_Purpose-1534899.pdf> GRM188R61A226ME15D <https://www.mouser.com/datasheet/2/281/1/GRM188R61A226ME15_02A-1985787.pdf> GRM188R61E106MA73D <https://www.mouser.com/datasheet/2/281/1/GRM188R61E106MA73_01A-1985806.pdf> 885012006013 <https://www.mouser.com/datasheet/2/445/885012006013-1726946.pdf> 2220Y6300105KXTWS2 <https://www.mouser.com/datasheet/2/218/SMD_High_and_Std_StackiCap_P62-1825512.pdf> Yageo Class 2, X5R <https://www.mouser.com/datasheet/2/447/UPY_GPHC_X5R_4V_to_50V_26-1827097.pdf> TDK C Series <https://www.mouser.com/ProductDetail/TDK/C3216X5R1V226M160AC?qs=%2Fha2pyFadujbcx9jh7lYl%2F4NeMoXFhdc8AqVWNq4wW6M2y7zl6GzBuhgtI0ngznN> AVX Automotive MLCC <https://www.mouser.com/datasheet/2/40/AutoMLCC-777028.pdf> KEMET X7R Series <https://www.mouser.com/datasheet/2/212/KEM_C1002_X7R_SMD-1102033.pdf> Kyocera AVX <https://www.mouser.com/datasheet/2/40/C0GNP0_Dielectric-951274.pdf> GRM21BR61H <https://www.mouser.com/datasheet/2/281/1/GRM21BR61H106KE43_01A-1986884.pdf> C1812W104KDRACTU <https://www.mouser.com/datasheet/2/212/KEM_C1034_X7R_HV_ARC_SMD-1101730.pdf>; CAPACITANCE: 10µF; DKPN: 490-7202-1-ND; MANUFACTURER: Murata Electronics; MOPN: 81-GRM188R61E106MA3D; MPN: GRM188R61E106MA73D; TOLERANCE: 20%; VOLTAGE: 25V
C5-C7 = HyTechDevices:CAPACITOR_?_*: Capacitor, Non-Polarized VJ...1BC Series Datasheet <https://www.mouser.com/datasheet/2/427/vjw1bcbascomseries-1762447.pdf> Samsung Datasheet <https://www.mouser.com/datasheet/2/585/MLCC-1837944.pdf> Walsin Datasheet <https://www.mouser.com/datasheet/2/210/WTC_MLCC_General_Purpose-1534899.pdf> GRM188R61A226ME15D <https://www.mouser.com/datasheet/2/281/1/GRM188R61A226ME15_02A-1985787.pdf> GRM188R61E106MA73D <https://www.mouser.com/datasheet/2/281/1/GRM188R61E106MA73_01A-1985806.pdf> 885012006013 <https://www.mouser.com/datasheet/2/445/885012006013-1726946.pdf> 2220Y6300105KXTWS2 <https://www.mouser.com/datasheet/2/218/SMD_High_and_Std_StackiCap_P62-1825512.pdf> Yageo Class 2, X5R <https://www.mouser.com/datasheet/2/447/UPY_GPHC_X5R_4V_to_50V_26-1827097.pdf> TDK C Series <https://www.mouser.com/ProductDetail/TDK/C3216X5R1V226M160AC?qs=%2Fha2pyFadujbcx9jh7lYl%2F4NeMoXFhdc8AqVWNq4wW6M2y7zl6GzBuhgtI0ngznN> AVX Automotive MLCC <https://www.mouser.com/datasheet/2/40/AutoMLCC-777028.pdf> KEMET X7R Series <https://www.mouser.com/datasheet/2/212/KEM_C1002_X7R_SMD-1102033.pdf> Kyocera AVX <https://www.mouser.com/datasheet/2/40/C0GNP0_Dielectric-951274.pdf> GRM21BR61H <https://www.mouser.com/datasheet/2/281/1/GRM21BR61H106KE43_01A-1986884.pdf> C1812W104KDRACTU <https://www.mouser.com/datasheet/2/212/KEM_C1034_X7R_HV_ARC_SMD-1101730.pdf>; CAPACITANCE: 4.7nF; DKPN: 732-7931-1-ND; MANUFACTURER: Würth Elektronik; MOPN: 710-885012206012; MPN: 885012206012; TOLERANCE: 10%; VOLTAGE: 10V
C8 C9 C12-C20 C23 C30 C32-C35 C37 C39 C41 C43 C45 C47 C49 C51 C53-C55 C59 C61 C63 C65 C67 C69 C71 C73 C75 C77-C81 C84 C85 C87 C89 C92 C93 C95 C99-C103 = HyTechDevices:CAPACITOR_?_*: Capacitor, Non-Polarized VJ...1BC Series Datasheet <https://www.mouser.com/datasheet/2/427/vjw1bcbascomseries-1762447.pdf> Samsung Datasheet <https://www.mouser.com/datasheet/2/585/MLCC-1837944.pdf> Walsin Datasheet <https://www.mouser.com/datasheet/2/210/WTC_MLCC_General_Purpose-1534899.pdf> GRM188R61A226ME15D <https://www.mouser.com/datasheet/2/281/1/GRM188R61A226ME15_02A-1985787.pdf> GRM188R61E106MA73D <https://www.mouser.com/datasheet/2/281/1/GRM188R61E106MA73_01A-1985806.pdf> 885012006013 <https://www.mouser.com/datasheet/2/445/885012006013-1726946.pdf> 2220Y6300105KXTWS2 <https://www.mouser.com/datasheet/2/218/SMD_High_and_Std_StackiCap_P62-1825512.pdf> Yageo Class 2, X5R <https://www.mouser.com/datasheet/2/447/UPY_GPHC_X5R_4V_to_50V_26-1827097.pdf> TDK C Series <https://www.mouser.com/ProductDetail/TDK/C3216X5R1V226M160AC?qs=%2Fha2pyFadujbcx9jh7lYl%2F4NeMoXFhdc8AqVWNq4wW6M2y7zl6GzBuhgtI0ngznN> AVX Automotive MLCC <https://www.mouser.com/datasheet/2/40/AutoMLCC-777028.pdf> KEMET X7R Series <https://www.mouser.com/datasheet/2/212/KEM_C1002_X7R_SMD-1102033.pdf> Kyocera AVX <https://www.mouser.com/datasheet/2/40/C0GNP0_Dielectric-951274.pdf> GRM21BR61H <https://www.mouser.com/datasheet/2/281/1/GRM21BR61H106KE43_01A-1986884.pdf> C1812W104KDRACTU <https://www.mouser.com/datasheet/2/212/KEM_C1034_X7R_HV_ARC_SMD-1101730.pdf>; CAPACITANCE: 0.1µF; DKPN: 720-1688-1-ND; MANUFACTURER: Vishay Vitramon; MOPN: 77-VJ0603Y104JXQPBC; MPN: VJ0603Y104JXQPW1BC; TOLERANCE: 5%; VOLTAGE: 10V
C10 C11 C21 C22 C24 C25 C31 C40 C42 C48 C50 C56 C57 C60 C62 C68 C70 C76 C82 C83 C86 C90 = HyTechDevices:CAPACITOR_?_*: Capacitor, Non-Polarized VJ...1BC Series Datasheet <https://www.mouser.com/datasheet/2/427/vjw1bcbascomseries-1762447.pdf> Samsung Datasheet <https://www.mouser.com/datasheet/2/585/MLCC-1837944.pdf> Walsin Datasheet <https://www.mouser.com/datasheet/2/210/WTC_MLCC_General_Purpose-1534899.pdf> GRM188R61A226ME15D <https://www.mouser.com/datasheet/2/281/1/GRM188R61A226ME15_02A-1985787.pdf> GRM188R61E106MA73D <https://www.mouser.com/datasheet/2/281/1/GRM188R61E106MA73_01A-1985806.pdf> 885012006013 <https://www.mouser.com/datasheet/2/445/885012006013-1726946.pdf> 2220Y6300105KXTWS2 <https://www.mouser.com/datasheet/2/218/SMD_High_and_Std_StackiCap_P62-1825512.pdf> Yageo Class 2, X5R <https://www.mouser.com/datasheet/2/447/UPY_GPHC_X5R_4V_to_50V_26-1827097.pdf> TDK C Series <https://www.mouser.com/ProductDetail/TDK/C3216X5R1V226M160AC?qs=%2Fha2pyFadujbcx9jh7lYl%2F4NeMoXFhdc8AqVWNq4wW6M2y7zl6GzBuhgtI0ngznN> AVX Automotive MLCC <https://www.mouser.com/datasheet/2/40/AutoMLCC-777028.pdf> KEMET X7R Series <https://www.mouser.com/datasheet/2/212/KEM_C1002_X7R_SMD-1102033.pdf> Kyocera AVX <https://www.mouser.com/datasheet/2/40/C0GNP0_Dielectric-951274.pdf> GRM21BR61H <https://www.mouser.com/datasheet/2/281/1/GRM21BR61H106KE43_01A-1986884.pdf> C1812W104KDRACTU <https://www.mouser.com/datasheet/2/212/KEM_C1034_X7R_HV_ARC_SMD-1101730.pdf>; CAPACITANCE: 1µF; DKPN: 311-1796-1-ND; MANUFACTURER: Yageo; MOPN: 603-CC603KRX7R6BB105; MPN: CC0603KRX7R6BB105; TOLERANCE: 10%; VOLTAGE: 10V
C26 = HyTechDevices:CAPACITOR_ELECTROLYTIC_?_*: A759 Series Aluminium Hybrid Electrolytic Capacitor Datasheet <https://www.mouser.com/datasheet/2/212/KEM_A4072_A759-1104329.pdf> EEH_AZS Hybrid Electrolytic Capacitor Datasheet <https://www.mouser.com/datasheet/2/315/DMD0000COL92-1141863.pdf> EEU-FP1E Aluminum Electrolytic Capacitor Datasheet <https://www.mouser.com/datasheet/2/315/RDF0000C1260-1391675.pdf>; CAPACITANCE: 470uF; DKPN: 10-EEH-AZS1V471BCT-ND; MANUFACTURER: Panasonic Electronic Components; MOPN: 667-EEH-AZS1V471B; MPN: EEH-AZS1V471B; TOLERANCE: 20&; VOLTAGE: 35V
C28 = HyTechDevices:CAPACITOR_?_*: Capacitor, Non-Polarized VJ...1BC Series Datasheet <https://www.mouser.com/datasheet/2/427/vjw1bcbascomseries-1762447.pdf> Samsung Datasheet <https://www.mouser.com/datasheet/2/585/MLCC-1837944.pdf> Walsin Datasheet <https://www.mouser.com/datasheet/2/210/WTC_MLCC_General_Purpose-1534899.pdf> GRM188R61A226ME15D <https://www.mouser.com/datasheet/2/281/1/GRM188R61A226ME15_02A-1985787.pdf> GRM188R61E106MA73D <https://www.mouser.com/datasheet/2/281/1/GRM188R61E106MA73_01A-1985806.pdf> 885012006013 <https://www.mouser.com/datasheet/2/445/885012006013-1726946.pdf> 2220Y6300105KXTWS2 <https://www.mouser.com/datasheet/2/218/SMD_High_and_Std_StackiCap_P62-1825512.pdf> Yageo Class 2, X5R <https://www.mouser.com/datasheet/2/447/UPY_GPHC_X5R_4V_to_50V_26-1827097.pdf> TDK C Series <https://www.mouser.com/ProductDetail/TDK/C3216X5R1V226M160AC?qs=%2Fha2pyFadujbcx9jh7lYl%2F4NeMoXFhdc8AqVWNq4wW6M2y7zl6GzBuhgtI0ngznN> AVX Automotive MLCC <https://www.mouser.com/datasheet/2/40/AutoMLCC-777028.pdf> KEMET X7R Series <https://www.mouser.com/datasheet/2/212/KEM_C1002_X7R_SMD-1102033.pdf> Kyocera AVX <https://www.mouser.com/datasheet/2/40/C0GNP0_Dielectric-951274.pdf> GRM21BR61H <https://www.mouser.com/datasheet/2/281/1/GRM21BR61H106KE43_01A-1986884.pdf> C1812W104KDRACTU <https://www.mouser.com/datasheet/2/212/KEM_C1034_X7R_HV_ARC_SMD-1101730.pdf>; CAPACITANCE: 1µF; DKPN: 1276-1184-1-ND; MANUFACTURER: Samsung Electro-Mechanics; MOPN: 187-CL10B105KA8NNNC; MPN: CL10B105KA8NNNC; TOLERANCE: 10%; VOLTAGE: 25V
C29 = HyTechDevices:CAPACITOR_?_*: Capacitor, Non-Polarized VJ...1BC Series Datasheet <https://www.mouser.com/datasheet/2/427/vjw1bcbascomseries-1762447.pdf> Samsung Datasheet <https://www.mouser.com/datasheet/2/585/MLCC-1837944.pdf> Walsin Datasheet <https://www.mouser.com/datasheet/2/210/WTC_MLCC_General_Purpose-1534899.pdf> GRM188R61A226ME15D <https://www.mouser.com/datasheet/2/281/1/GRM188R61A226ME15_02A-1985787.pdf> GRM188R61E106MA73D <https://www.mouser.com/datasheet/2/281/1/GRM188R61E106MA73_01A-1985806.pdf> 885012006013 <https://www.mouser.com/datasheet/2/445/885012006013-1726946.pdf> 2220Y6300105KXTWS2 <https://www.mouser.com/datasheet/2/218/SMD_High_and_Std_StackiCap_P62-1825512.pdf> Yageo Class 2, X5R <https://www.mouser.com/datasheet/2/447/UPY_GPHC_X5R_4V_to_50V_26-1827097.pdf> TDK C Series <https://www.mouser.com/ProductDetail/TDK/C3216X5R1V226M160AC?qs=%2Fha2pyFadujbcx9jh7lYl%2F4NeMoXFhdc8AqVWNq4wW6M2y7zl6GzBuhgtI0ngznN> AVX Automotive MLCC <https://www.mouser.com/datasheet/2/40/AutoMLCC-777028.pdf> KEMET X7R Series <https://www.mouser.com/datasheet/2/212/KEM_C1002_X7R_SMD-1102033.pdf> Kyocera AVX <https://www.mouser.com/datasheet/2/40/C0GNP0_Dielectric-951274.pdf> GRM21BR61H <https://www.mouser.com/datasheet/2/281/1/GRM21BR61H106KE43_01A-1986884.pdf> C1812W104KDRACTU <https://www.mouser.com/datasheet/2/212/KEM_C1034_X7R_HV_ARC_SMD-1101730.pdf>; CAPACITANCE: 0.1µF; DKPN: 1276-1006-1-ND; MANUFACTURER: Samsung Electro-Mechanics; MOPN: 187-CL10B104KA8NNNC; MPN: CL10B104KA8NNNC; TOLERANCE: 10%; VOLTAGE: 25V
C36 C38 C44 C46 C52 C58 C64 C66 C72 C74 C88 C91 C94 C96-C98 C105-C115 = HyTechDevices:CAPACITOR_?_*: Capacitor, Non-Polarized VJ...1BC Series Datasheet <https://www.mouser.com/datasheet/2/427/vjw1bcbascomseries-1762447.pdf> Samsung Datasheet <https://www.mouser.com/datasheet/2/585/MLCC-1837944.pdf> Walsin Datasheet <https://www.mouser.com/datasheet/2/210/WTC_MLCC_General_Purpose-1534899.pdf> GRM188R61A226ME15D <https://www.mouser.com/datasheet/2/281/1/GRM188R61A226ME15_02A-1985787.pdf> GRM188R61E106MA73D <https://www.mouser.com/datasheet/2/281/1/GRM188R61E106MA73_01A-1985806.pdf> 885012006013 <https://www.mouser.com/datasheet/2/445/885012006013-1726946.pdf> 2220Y6300105KXTWS2 <https://www.mouser.com/datasheet/2/218/SMD_High_and_Std_StackiCap_P62-1825512.pdf> Yageo Class 2, X5R <https://www.mouser.com/datasheet/2/447/UPY_GPHC_X5R_4V_to_50V_26-1827097.pdf> TDK C Series <https://www.mouser.com/ProductDetail/TDK/C3216X5R1V226M160AC?qs=%2Fha2pyFadujbcx9jh7lYl%2F4NeMoXFhdc8AqVWNq4wW6M2y7zl6GzBuhgtI0ngznN> AVX Automotive MLCC <https://www.mouser.com/datasheet/2/40/AutoMLCC-777028.pdf> KEMET X7R Series <https://www.mouser.com/datasheet/2/212/KEM_C1002_X7R_SMD-1102033.pdf> Kyocera AVX <https://www.mouser.com/datasheet/2/40/C0GNP0_Dielectric-951274.pdf> GRM21BR61H <https://www.mouser.com/datasheet/2/281/1/GRM21BR61H106KE43_01A-1986884.pdf> C1812W104KDRACTU <https://www.mouser.com/datasheet/2/212/KEM_C1034_X7R_HV_ARC_SMD-1101730.pdf>; CAPACITANCE: 680pF; DKPN: 732-7757-1-ND; MANUFACTURER: Würth Elektronik; MOPN: 710-885012006013; MPN: 885012006013; TOLERANCE: 5%; VOLTAGE: 10V
D1-D3 = HyTechDevices:TVS_BIDIRECTIONAL_DUAL: Bdirectional TVS for CAN ESD Datasheet <https://www.ti.com/lit/ds/symlink/tpd2e007.pdf?HQS=dis-mous-null-mousermode-dsf-pf-null-wwe&ts=1615155679700&ref_url=https%253A%252F%252Fwww.mouser.com%252F>; DKPN: 296-25281-1-ND; MANUFACTURER: Texas Instruments; MOPN: 595-TPD2E007DCKR; MPN: TPD2E007DCKR
D4-D7 D24 D25 D34 D35 D45 D46 = HyTechDevices:SCHOTTKY_?_*: CUS08F30 Shottky Diode Datasheet <https://www.mouser.com/datasheet/2/408/CUS08F30_datasheet_en_20140414-1916097.pdf>; CURRENT: 0.8A; DKPN: CUS08F30H3FTR-ND; MANUFACTURER: Toshiba Semiconductor and Storage; MOPN: 757-CUS08F30H3F; MPN: CUS08F30; VOLTAGE: 30V
D16-D23 D26 D27 D41 = HyTechDevices:TVS_?_*: TVS Diode GSOT Datasheet <https://www.mouser.com/datasheet/2/427/gsot03-1767593.pdf>; DKPN: 118-1.5SMBJ28ATR-ND; MANUFACTURER: Bourns Inc.; MOPN: 652-1.5SMBJ28A; MPN: 1.5SMBJ28A; VOLTAGE: 28V
D28 = HyTechDevices:TVS_?_*: TVS Diode GSOT Datasheet <https://www.mouser.com/datasheet/2/427/gsot03-1767593.pdf>; DKPN: GSOT05-E3-08TR-ND; MANUFACTURER: Vishay General Semiconductor - Diodes Division; MOPN: 78-GSOT05-E3-08; MPN: GSOT05-E3-08; VOLTAGE: 5V
D36-D39 = HyTechDevices:TVS_?_*: TVS Diode GSOT Datasheet <https://www.mouser.com/datasheet/2/427/gsot03-1767593.pdf>; DKPN: GSOT15-E3-08CT-ND; MANUFACTURER: Vishay General Semiconductor - Diodes Division; MOPN: 78-GSOT15-E3-08; MPN: GSOT15-E3-08; VOLTAGE: 15V
J1 J3 = HyTechDevices:CONNECTOR-34_?_*: 34 pin ribbon connector header (EHT-117-01) Catalog <https://suddendocs.samtec.com/catalog_english/eht.pdf> Datasheet <http://suddendocs.samtec.com/prints/eht-d.pdf> Part <https://www.digikey.com/en/products/detail/samtec-inc/EHT-117-01-L-D/6694623>; DKPN: SAM15557-ND; MANUFACTURER: Samtec; MOPN: 200-EHT11701LD; MPN: EHT-117-01-L-D
J2 = HyTechDevices:ADIS16460*: 14 pin connector specifically for ADIS16460 IMU Samtec Tiger Claw Datasheet <https://suddendocs.samtec.com/catalog_english/clm_sm.pdf> ADIS16460 Datasheet <https://www.analog.com/media/en/technical-documentation/data-sheets/ADIS16460.pdf>; DKPN: SAM1129-07-ND; MANUFACTURER: Samtec Inc.; MPN: CLM-107-02
JP1 JP2 JP8 JP9 = HyTechDevices:JUMPER_?_*: 2 Pin Connector; DKPN: 13-RC0603FR-130RLTR-ND; MANUFACTURER: YAGEO; MOPN: 603-RC0603FR-130RL; MPN: RC0603FR-130RL
JP3-JP7 = HyTechDevices:JUMPER_?_*: 2 Pin Connector; DKPN: S1011EC-02-ND; MANUFACTURER: Sullins Connector Solutions; MPN: PRPC002SAAN-RC
K1 K9-K12 = HyTechDevices:RELAY_DPDT_*: Dual Pole, Dual Throw Relay Datasheet <https://www.mouser.com/datasheet/2/418/5/NG_DS_RT2_1014-572844.pdf>; DKPN: PB2077CT-ND; MANUFACTURER: TE Connectivity; MOPN: 655-3-1462039-7; MPN: 3-1462039-7
LATCH = HyTechDevices:LED_?_*: LED 0603 Blue <https://www.mouser.com/datasheet/2/216/APT1608VBC_D-246010.pdf> Green <https://www.mouser.com/datasheet/2/216/APT1608ZGCK-1173388.pdf> Orange <https://www.mouser.com/datasheet/2/216/APT1608SECK-6197.pdf> Red <https://www.mouser.com/datasheet/2/216/APT1608SECK-J3-PRV-1173336.pdf> White <https://www.mouser.com/datasheet/2/50/SM0603UWC-880813.pdf> Yellow <https://www.mouser.com/datasheet/2/216/APT1608SYCK-J3-PRV-1173311.pdf> 2835 (Series not on Digikey) Lumiled LUXEON 2835 Color Line <https://www.mouser.com/datasheet/2/602/DS236_luxeon_2835_color_line_datasheet-1596094.pdf>; COLOR: White; DKPN: SM0603UWC-ND; MANUFACTURER: Bivar Inc.; MOPN: 749-SM0603UWC; MPN: SM0603UWC
Q3 Q5 = HyTechDevices:TRANSISTOR_P_MOS_?_*: P-MOSFET SI2369DS Datasheet <https://www.mouser.com/datasheet/2/427/si2369d-1764360.pdf> DMP3056L Datasheet <https://www.mouser.com/datasheet/2/115/DIOD_S_A0012915142_1-2543925.pdf>; DKPN: DMP3056L-7DITR-ND; MANUFACTURER: Diodes Incorporated; MOPN: 621-DMP3056L-7; MPN: DMP3056L-7
Q4 Q6 = HyTechDevices:TRANSISTOR_N_MOS_?_*: N-MOSFET PMV15ENEA Datasheet <https://www.mouser.com/datasheet/2/916/PMV15ENEA-1604828.pdf> TK6P65W Datasheet <https://www.mouser.com/datasheet/2/408/TK6P65W_datasheet_en_20151225-1916290.pdf> SIR638ADP Datasheet <https://www.mouser.com/datasheet/2/427/sir638adp-1766131.pdf> DMG3406L Datasheet <https://www.diodes.com/assets/Datasheets/DMG3406L.pdf> STL2N80K5 <https://www.mouser.com/datasheet/2/389/dm00092662-1798082.pdf>; DKPN: DMG3406L-7DITR-ND; MANUFACTURER: Diodes Incorporated; MOPN: 621-DMG3406L-7; MPN: DMG3406L-7
R1-R6 = HyTechDevices:RESISTOR_?_*: Resistor PWR163 Series <https://www.mouser.com/datasheet/2/54/pwr163-777985.pdf> AC Series <https://www.mouser.com/datasheet/2/447/Yageo_PYu_AC_51_RoHS_L_7_1714230-1874691.pdf> PU Series <https://www.mouser.com/datasheet/2/447/PYu-PU_51_RoHS_L_6-1504619.pdf> ERA Series <https://www.mouser.com/datasheet/2/315/AOA0000C307-1149632.pdf> PWR263 Series <https://www.mouser.com/datasheet/2/54/pwr263s_35-778069.pdf> KTR Series <https://www.mouser.com/datasheet/2/348/ROHM_S_A0011075115_1-2563276.pdf> RC Series <https://www.mouser.com/datasheet/2/447/Yageo_03_18_2021_PYu_RC_Group_51_RoHS_L_11-2199992.pdf> ERJ PB3, PB6 Series <https://www.mouser.com/datasheet/2/315/AOA0000C328-1530132.pdf> ERJ PA2, P03, PA3, P06, P08, P14 Series <https://www.mouser.com/datasheet/2/315/AOA0000C331-1141874.pdf> B20 Series <https://www.ohmite.com/assets/docs/res_200.pdf?r=false> TE Connectivity/Holsworthy RN73 Series <https://www.mouser.com/datasheet/2/418/4/NG_DS_1773270_M-604713.pdf> Vishay Dale D/CRCW e3 <https://www.mouser.com/datasheet/2/427/dcrcwe3-1762152.pdf> Ohmite B20 <https://www.ohmite.com/assets/docs/res_200.pdf?r=false>; DKPN: 311-60.4HRCT-ND; MANUFACTURER: Yageo; MOPN: 603-RC0603FR-0760R4L; MPN: RC0603FR-0760R4L; POWER: 0.1W; RESISTANCE: 60.4; TOLERANCE: 1%; VOLTAGE_CONTINUOUS: 2.48V; VOLTAGE_MAX: 75V
R7 R33 R42 R60 R61 R65 R98 R100 R103 R104 R107 R108 R111 R112 R115 R116 R119 R120 R123 R124 R127 R128 = HyTechDevices:RESISTOR_?_*: Resistor PWR163 Series <https://www.mouser.com/datasheet/2/54/pwr163-777985.pdf> AC Series <https://www.mouser.com/datasheet/2/447/Yageo_PYu_AC_51_RoHS_L_7_1714230-1874691.pdf> PU Series <https://www.mouser.com/datasheet/2/447/PYu-PU_51_RoHS_L_6-1504619.pdf> ERA Series <https://www.mouser.com/datasheet/2/315/AOA0000C307-1149632.pdf> PWR263 Series <https://www.mouser.com/datasheet/2/54/pwr263s_35-778069.pdf> KTR Series <https://www.mouser.com/datasheet/2/348/ROHM_S_A0011075115_1-2563276.pdf> RC Series <https://www.mouser.com/datasheet/2/447/Yageo_03_18_2021_PYu_RC_Group_51_RoHS_L_11-2199992.pdf> ERJ PB3, PB6 Series <https://www.mouser.com/datasheet/2/315/AOA0000C328-1530132.pdf> ERJ PA2, P03, PA3, P06, P08, P14 Series <https://www.mouser.com/datasheet/2/315/AOA0000C331-1141874.pdf> B20 Series <https://www.ohmite.com/assets/docs/res_200.pdf?r=false> TE Connectivity/Holsworthy RN73 Series <https://www.mouser.com/datasheet/2/418/4/NG_DS_1773270_M-604713.pdf> Vishay Dale D/CRCW e3 <https://www.mouser.com/datasheet/2/427/dcrcwe3-1762152.pdf> Ohmite B20 <https://www.ohmite.com/assets/docs/res_200.pdf?r=false>; DKPN: P10KBDCT-ND; MANUFACTURER: Panasonic Electronic Components; MOPN: 667-ERA-3ARB103V; MPN: ERA-3ARB103V; POWER: 0.1W; RESISTANCE: 10k; TOLERANCE: 0.1%; VOLTAGE_CONTINUOUS: 31.62V; VOLTAGE_MAX: 75V
R8 R9 R64 R66 = HyTechDevices:RESISTOR_?_*: Resistor PWR163 Series <https://www.mouser.com/datasheet/2/54/pwr163-777985.pdf> AC Series <https://www.mouser.com/datasheet/2/447/Yageo_PYu_AC_51_RoHS_L_7_1714230-1874691.pdf> PU Series <https://www.mouser.com/datasheet/2/447/PYu-PU_51_RoHS_L_6-1504619.pdf> ERA Series <https://www.mouser.com/datasheet/2/315/AOA0000C307-1149632.pdf> PWR263 Series <https://www.mouser.com/datasheet/2/54/pwr263s_35-778069.pdf> KTR Series <https://www.mouser.com/datasheet/2/348/ROHM_S_A0011075115_1-2563276.pdf> RC Series <https://www.mouser.com/datasheet/2/447/Yageo_03_18_2021_PYu_RC_Group_51_RoHS_L_11-2199992.pdf> ERJ PB3, PB6 Series <https://www.mouser.com/datasheet/2/315/AOA0000C328-1530132.pdf> ERJ PA2, P03, PA3, P06, P08, P14 Series <https://www.mouser.com/datasheet/2/315/AOA0000C331-1141874.pdf> B20 Series <https://www.ohmite.com/assets/docs/res_200.pdf?r=false> TE Connectivity/Holsworthy RN73 Series <https://www.mouser.com/datasheet/2/418/4/NG_DS_1773270_M-604713.pdf> Vishay Dale D/CRCW e3 <https://www.mouser.com/datasheet/2/427/dcrcwe3-1762152.pdf> Ohmite B20 <https://www.ohmite.com/assets/docs/res_200.pdf?r=false>; DKPN: 311-5.10KHRTR-ND; MANUFACTURER: Yageo; MOPN: 603-RC0603FR-075K1L; MPN: RC0603FR-075K1L; POWER: 0.1W; RESISTANCE: 5.1k; TOLERANCE: 1%; VOLTAGE_CONTINUOUS: 22.58V; VOLTAGE_MAX: 75V
R10 R62 R74 = HyTechDevices:RESISTOR_?_*: Resistor PWR163 Series <https://www.mouser.com/datasheet/2/54/pwr163-777985.pdf> AC Series <https://www.mouser.com/datasheet/2/447/Yageo_PYu_AC_51_RoHS_L_7_1714230-1874691.pdf> PU Series <https://www.mouser.com/datasheet/2/447/PYu-PU_51_RoHS_L_6-1504619.pdf> ERA Series <https://www.mouser.com/datasheet/2/315/AOA0000C307-1149632.pdf> PWR263 Series <https://www.mouser.com/datasheet/2/54/pwr263s_35-778069.pdf> KTR Series <https://www.mouser.com/datasheet/2/348/ROHM_S_A0011075115_1-2563276.pdf> RC Series <https://www.mouser.com/datasheet/2/447/Yageo_03_18_2021_PYu_RC_Group_51_RoHS_L_11-2199992.pdf> ERJ PB3, PB6 Series <https://www.mouser.com/datasheet/2/315/AOA0000C328-1530132.pdf> ERJ PA2, P03, PA3, P06, P08, P14 Series <https://www.mouser.com/datasheet/2/315/AOA0000C331-1141874.pdf> B20 Series <https://www.ohmite.com/assets/docs/res_200.pdf?r=false> TE Connectivity/Holsworthy RN73 Series <https://www.mouser.com/datasheet/2/418/4/NG_DS_1773270_M-604713.pdf> Vishay Dale D/CRCW e3 <https://www.mouser.com/datasheet/2/427/dcrcwe3-1762152.pdf> Ohmite B20 <https://www.ohmite.com/assets/docs/res_200.pdf?r=false>; DKPN: P1.13KHCT-ND; MANUFACTURER: Panasonic Electronic Components; MOPN: 667-ERJ-3EKF1131V; MPN: ERJ-3EKF1131V; POWER: 0.1W; RESISTANCE: 1.13k; TOLERANCE: 1%; VOLTAGE_CONTINUOUS: 75V; VOLTAGE_MAX: 150V
R11 R63 R75 = HyTechDevices:RESISTOR_?_*: Resistor PWR163 Series <https://www.mouser.com/datasheet/2/54/pwr163-777985.pdf> AC Series <https://www.mouser.com/datasheet/2/447/Yageo_PYu_AC_51_RoHS_L_7_1714230-1874691.pdf> PU Series <https://www.mouser.com/datasheet/2/447/PYu-PU_51_RoHS_L_6-1504619.pdf> ERA Series <https://www.mouser.com/datasheet/2/315/AOA0000C307-1149632.pdf> PWR263 Series <https://www.mouser.com/datasheet/2/54/pwr263s_35-778069.pdf> KTR Series <https://www.mouser.com/datasheet/2/348/ROHM_S_A0011075115_1-2563276.pdf> RC Series <https://www.mouser.com/datasheet/2/447/Yageo_03_18_2021_PYu_RC_Group_51_RoHS_L_11-2199992.pdf> ERJ PB3, PB6 Series <https://www.mouser.com/datasheet/2/315/AOA0000C328-1530132.pdf> ERJ PA2, P03, PA3, P06, P08, P14 Series <https://www.mouser.com/datasheet/2/315/AOA0000C331-1141874.pdf> B20 Series <https://www.ohmite.com/assets/docs/res_200.pdf?r=false> TE Connectivity/Holsworthy RN73 Series <https://www.mouser.com/datasheet/2/418/4/NG_DS_1773270_M-604713.pdf> Vishay Dale D/CRCW e3 <https://www.mouser.com/datasheet/2/427/dcrcwe3-1762152.pdf> Ohmite B20 <https://www.ohmite.com/assets/docs/res_200.pdf?r=false>; DKPN: P10.2KDBCT-ND; MANUFACTURER: Panasonic Electronic Components; MOPN: 667-ERA-3AEB1022V; MPN: ERA-3AEB1022V; POWER: 0.1W; RESISTANCE: 10.2k; TOLERANCE: 0.1%; VOLTAGE_CONTINUOUS: 31.94V; VOLTAGE_MAX: 75V
R12 R34 = HyTechDevices:RESISTOR_?_*: Resistor PWR163 Series <https://www.mouser.com/datasheet/2/54/pwr163-777985.pdf> AC Series <https://www.mouser.com/datasheet/2/447/Yageo_PYu_AC_51_RoHS_L_7_1714230-1874691.pdf> PU Series <https://www.mouser.com/datasheet/2/447/PYu-PU_51_RoHS_L_6-1504619.pdf> ERA Series <https://www.mouser.com/datasheet/2/315/AOA0000C307-1149632.pdf> PWR263 Series <https://www.mouser.com/datasheet/2/54/pwr263s_35-778069.pdf> KTR Series <https://www.mouser.com/datasheet/2/348/ROHM_S_A0011075115_1-2563276.pdf> RC Series <https://www.mouser.com/datasheet/2/447/Yageo_03_18_2021_PYu_RC_Group_51_RoHS_L_11-2199992.pdf> ERJ PB3, PB6 Series <https://www.mouser.com/datasheet/2/315/AOA0000C328-1530132.pdf> ERJ PA2, P03, PA3, P06, P08, P14 Series <https://www.mouser.com/datasheet/2/315/AOA0000C331-1141874.pdf> B20 Series <https://www.ohmite.com/assets/docs/res_200.pdf?r=false> TE Connectivity/Holsworthy RN73 Series <https://www.mouser.com/datasheet/2/418/4/NG_DS_1773270_M-604713.pdf> Vishay Dale D/CRCW e3 <https://www.mouser.com/datasheet/2/427/dcrcwe3-1762152.pdf> Ohmite B20 <https://www.ohmite.com/assets/docs/res_200.pdf?r=false>; DKPN: P120DBCT-ND; MANUFACTURER: Panasonic Electronic Components; MOPN: 667-ERA-3AEB121V; MPN: ERA-3AEB121V; POWER: 0.1W; RESISTANCE: 120; TOLERANCE: 0.1%; VOLTAGE_CONTINUOUS: 3.46V; VOLTAGE_MAX: 75V
R13 R37 R40 R54 R55 = HyTechDevices:RESISTOR_?_*: Resistor PWR163 Series <https://www.mouser.com/datasheet/2/54/pwr163-777985.pdf> AC Series <https://www.mouser.com/datasheet/2/447/Yageo_PYu_AC_51_RoHS_L_7_1714230-1874691.pdf> PU Series <https://www.mouser.com/datasheet/2/447/PYu-PU_51_RoHS_L_6-1504619.pdf> ERA Series <https://www.mouser.com/datasheet/2/315/AOA0000C307-1149632.pdf> PWR263 Series <https://www.mouser.com/datasheet/2/54/pwr263s_35-778069.pdf> KTR Series <https://www.mouser.com/datasheet/2/348/ROHM_S_A0011075115_1-2563276.pdf> RC Series <https://www.mouser.com/datasheet/2/447/Yageo_03_18_2021_PYu_RC_Group_51_RoHS_L_11-2199992.pdf> ERJ PB3, PB6 Series <https://www.mouser.com/datasheet/2/315/AOA0000C328-1530132.pdf> ERJ PA2, P03, PA3, P06, P08, P14 Series <https://www.mouser.com/datasheet/2/315/AOA0000C331-1141874.pdf> B20 Series <https://www.ohmite.com/assets/docs/res_200.pdf?r=false> TE Connectivity/Holsworthy RN73 Series <https://www.mouser.com/datasheet/2/418/4/NG_DS_1773270_M-604713.pdf> Vishay Dale D/CRCW e3 <https://www.mouser.com/datasheet/2/427/dcrcwe3-1762152.pdf> Ohmite B20 <https://www.ohmite.com/assets/docs/res_200.pdf?r=false>; DKPN: 311-240HRCT-ND; MANUFACTURER: Yageo; MOPN: 603-RC0603FR-07240RL; MPN: RC0603FR-07240RL; POWER: 0.1W; RESISTANCE: 240; TOLERANCE: 1%; VOLTAGE_CONTINUOUS: 4.90V; VOLTAGE_MAX: 75V
R14 R15 R130 R132 R134 R136 R138 R140 R142 R144 R146 = HyTechDevices:RESISTOR_?_*: Resistor PWR163 Series <https://www.mouser.com/datasheet/2/54/pwr163-777985.pdf> AC Series <https://www.mouser.com/datasheet/2/447/Yageo_PYu_AC_51_RoHS_L_7_1714230-1874691.pdf> PU Series <https://www.mouser.com/datasheet/2/447/PYu-PU_51_RoHS_L_6-1504619.pdf> ERA Series <https://www.mouser.com/datasheet/2/315/AOA0000C307-1149632.pdf> PWR263 Series <https://www.mouser.com/datasheet/2/54/pwr263s_35-778069.pdf> KTR Series <https://www.mouser.com/datasheet/2/348/ROHM_S_A0011075115_1-2563276.pdf> RC Series <https://www.mouser.com/datasheet/2/447/Yageo_03_18_2021_PYu_RC_Group_51_RoHS_L_11-2199992.pdf> ERJ PB3, PB6 Series <https://www.mouser.com/datasheet/2/315/AOA0000C328-1530132.pdf> ERJ PA2, P03, PA3, P06, P08, P14 Series <https://www.mouser.com/datasheet/2/315/AOA0000C331-1141874.pdf> B20 Series <https://www.ohmite.com/assets/docs/res_200.pdf?r=false> TE Connectivity/Holsworthy RN73 Series <https://www.mouser.com/datasheet/2/418/4/NG_DS_1773270_M-604713.pdf> Vishay Dale D/CRCW e3 <https://www.mouser.com/datasheet/2/427/dcrcwe3-1762152.pdf> Ohmite B20 <https://www.ohmite.com/assets/docs/res_200.pdf?r=false>; DKPN: 311-36.5KHRCT-ND; MANUFACTURER: Yageo; MOPN: 603-RC0603FR-0736K5L; MPN: RC0603FR-0736K5L; POWER: 0.1W; RESISTANCE: 36.5k; TOLERANCE: 1%; VOLTAGE_CONTINUOUS: 60.42V; VOLTAGE_MAX: 75V
R16 R129 R131 R133 R135 R137 R139 R141 R143 R145 R147 = HyTechDevices:RESISTOR_?_*: Resistor PWR163 Series <https://www.mouser.com/datasheet/2/54/pwr163-777985.pdf> AC Series <https://www.mouser.com/datasheet/2/447/Yageo_PYu_AC_51_RoHS_L_7_1714230-1874691.pdf> PU Series <https://www.mouser.com/datasheet/2/447/PYu-PU_51_RoHS_L_6-1504619.pdf> ERA Series <https://www.mouser.com/datasheet/2/315/AOA0000C307-1149632.pdf> PWR263 Series <https://www.mouser.com/datasheet/2/54/pwr263s_35-778069.pdf> KTR Series <https://www.mouser.com/datasheet/2/348/ROHM_S_A0011075115_1-2563276.pdf> RC Series <https://www.mouser.com/datasheet/2/447/Yageo_03_18_2021_PYu_RC_Group_51_RoHS_L_11-2199992.pdf> ERJ PB3, PB6 Series <https://www.mouser.com/datasheet/2/315/AOA0000C328-1530132.pdf> ERJ PA2, P03, PA3, P06, P08, P14 Series <https://www.mouser.com/datasheet/2/315/AOA0000C331-1141874.pdf> B20 Series <https://www.ohmite.com/assets/docs/res_200.pdf?r=false> TE Connectivity/Holsworthy RN73 Series <https://www.mouser.com/datasheet/2/418/4/NG_DS_1773270_M-604713.pdf> Vishay Dale D/CRCW e3 <https://www.mouser.com/datasheet/2/427/dcrcwe3-1762152.pdf> Ohmite B20 <https://www.ohmite.com/assets/docs/res_200.pdf?r=false>; DKPN: 311-4.64KHRCT-ND; MANUFACTURER: Yageo; MOPN: 603-RC0603FR-074K64L; MPN: RC0603FR-074K64L; POWER: 0.1W; RESISTANCE: 4.64k; TOLERANCE: 1%; VOLTAGE_CONTINUOUS: 21.54V; VOLTAGE_MAX: 75V
R23 R31 = HyTechDevices:RESISTOR_?_*: Resistor PWR163 Series <https://www.mouser.com/datasheet/2/54/pwr163-777985.pdf> AC Series <https://www.mouser.com/datasheet/2/447/Yageo_PYu_AC_51_RoHS_L_7_1714230-1874691.pdf> PU Series <https://www.mouser.com/datasheet/2/447/PYu-PU_51_RoHS_L_6-1504619.pdf> ERA Series <https://www.mouser.com/datasheet/2/315/AOA0000C307-1149632.pdf> PWR263 Series <https://www.mouser.com/datasheet/2/54/pwr263s_35-778069.pdf> KTR Series <https://www.mouser.com/datasheet/2/348/ROHM_S_A0011075115_1-2563276.pdf> RC Series <https://www.mouser.com/datasheet/2/447/Yageo_03_18_2021_PYu_RC_Group_51_RoHS_L_11-2199992.pdf> ERJ PB3, PB6 Series <https://www.mouser.com/datasheet/2/315/AOA0000C328-1530132.pdf> ERJ PA2, P03, PA3, P06, P08, P14 Series <https://www.mouser.com/datasheet/2/315/AOA0000C331-1141874.pdf> B20 Series <https://www.ohmite.com/assets/docs/res_200.pdf?r=false> TE Connectivity/Holsworthy RN73 Series <https://www.mouser.com/datasheet/2/418/4/NG_DS_1773270_M-604713.pdf> Vishay Dale D/CRCW e3 <https://www.mouser.com/datasheet/2/427/dcrcwe3-1762152.pdf> Ohmite B20 <https://www.ohmite.com/assets/docs/res_200.pdf?r=false>; DKPN: 311-180HRCT-ND; MANUFACTURER: Yageo; MOPN: 603-RC0603FR-07180RL; MPN: RC0603FR-07180RL; POWER: 0.1W; RESISTANCE: 180; TOLERANCE: 1%; VOLTAGE_CONTINUOUS: 4.24V; VOLTAGE_MAX: 75V
R24-R30 R32 R38 R57 R67 R70-R72 = HyTechDevices:RESISTOR_?_*: Resistor PWR163 Series <https://www.mouser.com/datasheet/2/54/pwr163-777985.pdf> AC Series <https://www.mouser.com/datasheet/2/447/Yageo_PYu_AC_51_RoHS_L_7_1714230-1874691.pdf> PU Series <https://www.mouser.com/datasheet/2/447/PYu-PU_51_RoHS_L_6-1504619.pdf> ERA Series <https://www.mouser.com/datasheet/2/315/AOA0000C307-1149632.pdf> PWR263 Series <https://www.mouser.com/datasheet/2/54/pwr263s_35-778069.pdf> KTR Series <https://www.mouser.com/datasheet/2/348/ROHM_S_A0011075115_1-2563276.pdf> RC Series <https://www.mouser.com/datasheet/2/447/Yageo_03_18_2021_PYu_RC_Group_51_RoHS_L_11-2199992.pdf> ERJ PB3, PB6 Series <https://www.mouser.com/datasheet/2/315/AOA0000C328-1530132.pdf> ERJ PA2, P03, PA3, P06, P08, P14 Series <https://www.mouser.com/datasheet/2/315/AOA0000C331-1141874.pdf> B20 Series <https://www.ohmite.com/assets/docs/res_200.pdf?r=false> TE Connectivity/Holsworthy RN73 Series <https://www.mouser.com/datasheet/2/418/4/NG_DS_1773270_M-604713.pdf> Vishay Dale D/CRCW e3 <https://www.mouser.com/datasheet/2/427/dcrcwe3-1762152.pdf> Ohmite B20 <https://www.ohmite.com/assets/docs/res_200.pdf?r=false>; DKPN: 10-ERJ-UP3F2001VTR-ND; MANUFACTURER: Panasonic Electronic Components; MOPN: 667-ERJ-UP3F2001V; MPN: ERJ-UP3F2001V; POWER: 0.25W; RESISTANCE: 2k; TOLERANCE: 1%; VOLTAGE_CONTINUOUS: 22.36V; VOLTAGE_MAX: 150V
R39 R58 = HyTechDevices:RESISTOR_?_*: Resistor PWR163 Series <https://www.mouser.com/datasheet/2/54/pwr163-777985.pdf> AC Series <https://www.mouser.com/datasheet/2/447/Yageo_PYu_AC_51_RoHS_L_7_1714230-1874691.pdf> PU Series <https://www.mouser.com/datasheet/2/447/PYu-PU_51_RoHS_L_6-1504619.pdf> ERA Series <https://www.mouser.com/datasheet/2/315/AOA0000C307-1149632.pdf> PWR263 Series <https://www.mouser.com/datasheet/2/54/pwr263s_35-778069.pdf> KTR Series <https://www.mouser.com/datasheet/2/348/ROHM_S_A0011075115_1-2563276.pdf> RC Series <https://www.mouser.com/datasheet/2/447/Yageo_03_18_2021_PYu_RC_Group_51_RoHS_L_11-2199992.pdf> ERJ PB3, PB6 Series <https://www.mouser.com/datasheet/2/315/AOA0000C328-1530132.pdf> ERJ PA2, P03, PA3, P06, P08, P14 Series <https://www.mouser.com/datasheet/2/315/AOA0000C331-1141874.pdf> B20 Series <https://www.ohmite.com/assets/docs/res_200.pdf?r=false> TE Connectivity/Holsworthy RN73 Series <https://www.mouser.com/datasheet/2/418/4/NG_DS_1773270_M-604713.pdf> Vishay Dale D/CRCW e3 <https://www.mouser.com/datasheet/2/427/dcrcwe3-1762152.pdf> Ohmite B20 <https://www.ohmite.com/assets/docs/res_200.pdf?r=false>; DKPN: 1712-CPF-A-0603B1K0ETR-ND; MANUFACTURER: TE Connectivity Passive Product; MOPN: 279-CPF-A-0603B1K0E; MPN: CPF-A-0603B1K0E; POWER: 0.0625W; RESISTANCE: 1k; TOLERANCE: 0.1%; VOLTAGE_CONTINUOUS: 7.9V; VOLTAGE_MAX: 50V
R41 R59 = HyTechDevices:RESISTOR_?_*: Resistor PWR163 Series <https://www.mouser.com/datasheet/2/54/pwr163-777985.pdf> AC Series <https://www.mouser.com/datasheet/2/447/Yageo_PYu_AC_51_RoHS_L_7_1714230-1874691.pdf> PU Series <https://www.mouser.com/datasheet/2/447/PYu-PU_51_RoHS_L_6-1504619.pdf> ERA Series <https://www.mouser.com/datasheet/2/315/AOA0000C307-1149632.pdf> PWR263 Series <https://www.mouser.com/datasheet/2/54/pwr263s_35-778069.pdf> KTR Series <https://www.mouser.com/datasheet/2/348/ROHM_S_A0011075115_1-2563276.pdf> RC Series <https://www.mouser.com/datasheet/2/447/Yageo_03_18_2021_PYu_RC_Group_51_RoHS_L_11-2199992.pdf> ERJ PB3, PB6 Series <https://www.mouser.com/datasheet/2/315/AOA0000C328-1530132.pdf> ERJ PA2, P03, PA3, P06, P08, P14 Series <https://www.mouser.com/datasheet/2/315/AOA0000C331-1141874.pdf> B20 Series <https://www.ohmite.com/assets/docs/res_200.pdf?r=false> TE Connectivity/Holsworthy RN73 Series <https://www.mouser.com/datasheet/2/418/4/NG_DS_1773270_M-604713.pdf> Vishay Dale D/CRCW e3 <https://www.mouser.com/datasheet/2/427/dcrcwe3-1762152.pdf> Ohmite B20 <https://www.ohmite.com/assets/docs/res_200.pdf?r=false>; DKPN: 311-43.0KHRCT-ND; MANUFACTURER: Yageo; MOPN: 603-RC0603FR-0743KL; MPN: RC0603FR-0743KL; POWER: 0.1W; RESISTANCE: 43k; TOLERANCE: 1%; VOLTAGE_CONTINUOUS: 65.57V; VOLTAGE_MAX: 75V
R43 = HyTechDevices:RESISTOR_?_*: Resistor PWR163 Series <https://www.mouser.com/datasheet/2/54/pwr163-777985.pdf> AC Series <https://www.mouser.com/datasheet/2/447/Yageo_PYu_AC_51_RoHS_L_7_1714230-1874691.pdf> PU Series <https://www.mouser.com/datasheet/2/447/PYu-PU_51_RoHS_L_6-1504619.pdf> ERA Series <https://www.mouser.com/datasheet/2/315/AOA0000C307-1149632.pdf> PWR263 Series <https://www.mouser.com/datasheet/2/54/pwr263s_35-778069.pdf> KTR Series <https://www.mouser.com/datasheet/2/348/ROHM_S_A0011075115_1-2563276.pdf> RC Series <https://www.mouser.com/datasheet/2/447/Yageo_03_18_2021_PYu_RC_Group_51_RoHS_L_11-2199992.pdf> ERJ PB3, PB6 Series <https://www.mouser.com/datasheet/2/315/AOA0000C328-1530132.pdf> ERJ PA2, P03, PA3, P06, P08, P14 Series <https://www.mouser.com/datasheet/2/315/AOA0000C331-1141874.pdf> B20 Series <https://www.ohmite.com/assets/docs/res_200.pdf?r=false> TE Connectivity/Holsworthy RN73 Series <https://www.mouser.com/datasheet/2/418/4/NG_DS_1773270_M-604713.pdf> Vishay Dale D/CRCW e3 <https://www.mouser.com/datasheet/2/427/dcrcwe3-1762152.pdf> Ohmite B20 <https://www.ohmite.com/assets/docs/res_200.pdf?r=false>; DKPN: 311-2.55KHRCT-ND; MANUFACTURER: Yageo; MOPN: 603-RC0603FR-072K55L; MPN: RC0603FR-072K55L; POWER: 0.1W; RESISTANCE: 2.55k; TOLERANCE: 1%; VOLTAGE_CONTINUOUS: 15.97V; VOLTAGE_MAX: 75V
R80 R82 R84 R86 R88 R90 R105 R109 R113 R117 R121 R125 = HyTechDevices:RESISTOR_?_*: Resistor PWR163 Series <https://www.mouser.com/datasheet/2/54/pwr163-777985.pdf> AC Series <https://www.mouser.com/datasheet/2/447/Yageo_PYu_AC_51_RoHS_L_7_1714230-1874691.pdf> PU Series <https://www.mouser.com/datasheet/2/447/PYu-PU_51_RoHS_L_6-1504619.pdf> ERA Series <https://www.mouser.com/datasheet/2/315/AOA0000C307-1149632.pdf> PWR263 Series <https://www.mouser.com/datasheet/2/54/pwr263s_35-778069.pdf> KTR Series <https://www.mouser.com/datasheet/2/348/ROHM_S_A0011075115_1-2563276.pdf> RC Series <https://www.mouser.com/datasheet/2/447/Yageo_03_18_2021_PYu_RC_Group_51_RoHS_L_11-2199992.pdf> ERJ PB3, PB6 Series <https://www.mouser.com/datasheet/2/315/AOA0000C328-1530132.pdf> ERJ PA2, P03, PA3, P06, P08, P14 Series <https://www.mouser.com/datasheet/2/315/AOA0000C331-1141874.pdf> B20 Series <https://www.ohmite.com/assets/docs/res_200.pdf?r=false> TE Connectivity/Holsworthy RN73 Series <https://www.mouser.com/datasheet/2/418/4/NG_DS_1773270_M-604713.pdf> Vishay Dale D/CRCW e3 <https://www.mouser.com/datasheet/2/427/dcrcwe3-1762152.pdf> Ohmite B20 <https://www.ohmite.com/assets/docs/res_200.pdf?r=false>; DKPN: P13KBECT-ND; MANUFACTURER: Panasonic Electronic Components; MOPN: 667-ERA-3ARW133V; MPN: ERA-3ARW133V; POWER: 0.1W; RESISTANCE: 13k; TOLERANCE: 0.05%; VOLTAGE_CONTINUOUS: 75V; VOLTAGE_MAX: 150V
R81 R83 R85 R87 R89 R91 R106 R110 R114 R118 R122 R126 = HyTechDevices:RESISTOR_?_*: Resistor PWR163 Series <https://www.mouser.com/datasheet/2/54/pwr163-777985.pdf> AC Series <https://www.mouser.com/datasheet/2/447/Yageo_PYu_AC_51_RoHS_L_7_1714230-1874691.pdf> PU Series <https://www.mouser.com/datasheet/2/447/PYu-PU_51_RoHS_L_6-1504619.pdf> ERA Series <https://www.mouser.com/datasheet/2/315/AOA0000C307-1149632.pdf> PWR263 Series <https://www.mouser.com/datasheet/2/54/pwr263s_35-778069.pdf> KTR Series <https://www.mouser.com/datasheet/2/348/ROHM_S_A0011075115_1-2563276.pdf> RC Series <https://www.mouser.com/datasheet/2/447/Yageo_03_18_2021_PYu_RC_Group_51_RoHS_L_11-2199992.pdf> ERJ PB3, PB6 Series <https://www.mouser.com/datasheet/2/315/AOA0000C328-1530132.pdf> ERJ PA2, P03, PA3, P06, P08, P14 Series <https://www.mouser.com/datasheet/2/315/AOA0000C331-1141874.pdf> B20 Series <https://www.ohmite.com/assets/docs/res_200.pdf?r=false> TE Connectivity/Holsworthy RN73 Series <https://www.mouser.com/datasheet/2/418/4/NG_DS_1773270_M-604713.pdf> Vishay Dale D/CRCW e3 <https://www.mouser.com/datasheet/2/427/dcrcwe3-1762152.pdf> Ohmite B20 <https://www.ohmite.com/assets/docs/res_200.pdf?r=false>; DKPN: P20340TR-ND; MANUFACTURER: Panasonic Electronic Components; MOPN: 667-ERJ-PB3D3301V; MPN: ERJ-PB3D3301V; POWER: 0.2W; RESISTANCE: 3.3k; TOLERANCE: 0.5%; VOLTAGE_CONTINUOUS: 25.69V; VOLTAGE_MAX: 150
R92 R93 R95 R97 R99 = HyTechDevices:RESISTOR_?_*: Resistor PWR163 Series <https://www.mouser.com/datasheet/2/54/pwr163-777985.pdf> AC Series <https://www.mouser.com/datasheet/2/447/Yageo_PYu_AC_51_RoHS_L_7_1714230-1874691.pdf> PU Series <https://www.mouser.com/datasheet/2/447/PYu-PU_51_RoHS_L_6-1504619.pdf> ERA Series <https://www.mouser.com/datasheet/2/315/AOA0000C307-1149632.pdf> PWR263 Series <https://www.mouser.com/datasheet/2/54/pwr263s_35-778069.pdf> KTR Series <https://www.mouser.com/datasheet/2/348/ROHM_S_A0011075115_1-2563276.pdf> RC Series <https://www.mouser.com/datasheet/2/447/Yageo_03_18_2021_PYu_RC_Group_51_RoHS_L_11-2199992.pdf> ERJ PB3, PB6 Series <https://www.mouser.com/datasheet/2/315/AOA0000C328-1530132.pdf> ERJ PA2, P03, PA3, P06, P08, P14 Series <https://www.mouser.com/datasheet/2/315/AOA0000C331-1141874.pdf> B20 Series <https://www.ohmite.com/assets/docs/res_200.pdf?r=false> TE Connectivity/Holsworthy RN73 Series <https://www.mouser.com/datasheet/2/418/4/NG_DS_1773270_M-604713.pdf> Vishay Dale D/CRCW e3 <https://www.mouser.com/datasheet/2/427/dcrcwe3-1762152.pdf> Ohmite B20 <https://www.ohmite.com/assets/docs/res_200.pdf?r=false>; DKPN: 311-100KHRTR-ND; MANUFACTURER: Yageo; MOPN: 603-RC0603FR-07100KL; MPN: RC0603FR-07100KL; POWER: 0.1W; RESISTANCE: 100k; TOLERANCE: 1%; VOLTAGE_CONTINUOUS: 75V; VOLTAGE_MAX: 75V
S1 = HyTechDevices:BUTTON: Button Datasheet <https://www.mouser.com/datasheet/2/307/en_b3s-1221332.pdf>; DKPN: SW415-ND; MANUFACTURER: Omron; MOPN: 653-B3S-1000; MPN: B3S-1000
TP1-TP8 = HyTechDevices:TEST_POINT: Test Point for Probing; DKPN: 36-5015CT-ND; MANUFACTURER: Keystone Electronics; MOPN: 534-5015; MPN: 5015
U1 = HyTechDevices:VOLTAGE_REGULATOR_?_*: Voltage Regulators LDL1117S50R Datasheet <https://www.mouser.com/datasheet/2/389/dm00366442-1799212.pdf> NCP785AH120T1G <https://www.mouser.com/datasheet/2/308/NCP785A_D-1812704.pdf> LMS8117A Datasheet <https://www.ti.com/lit/ds/symlink/lms8117a.pdf?HQS> ST732M50R Datasheet <https://www.mouser.com/datasheet/2/389/st732-1830546.pdf> LM2937IMPX-10/NOPB Datasheet <https://www.ti.com/lit/ds/symlink/lm2937.pdf>; DKPN: LMS8117AMP-3.3/NOPBCT-ND; MANUFACTURER: Texas Instruments; MOPN: 926-LMS8117AMP33NOPB; MPN: LMS8117AMP-3.3/NOPB
U2-U4 U26 U29 U30 = HyTechDevices:TCAN1051*V-Q1: TCAN1051*V Can Tranciever Datasheet <https://www.ti.com/lit/ds/symlink/tcan1051hgv-q1.pdf?HQS=dis-mous-null-mousermode-dsf-pf-null-wwe&ts=1610765132518&ref_url=https%253A%252F%252Fwww.mouser.com%252Ff>; DKPN: 296-49935-1-ND; MANUFACTURER: Texas Instruments; MOPN: 595-TCAN1051HGVDQ1; MPN: TCAN1051HGVDRQ1
U5 = HyTechDevices:ADM8316: ADM8316 Watchdog Datasheet <https://www.mouser.com/datasheet/2/609/adm8316_8318_8319_8320_8321_8322-1503275.pdf>; DKPN: ADM8316WBX30ARJZR7TR-ND; MANUFACTURER: Analog Devices Inc.; MOPN: 584-M8316WBX30ARJZR7; MPN: ADM8316WBX30ARJZR7; RESET_VOLTAGE: 3V; TIMEOUT: 102ms
U6 U7 U23 U32 = HyTechDevices:ADC128S022: ADC128S022 8-channel Analog to Digital Regulator Datasheet <https://www.ti.com/lit/ds/symlink/adc128s022.pdf?ts=1609290895378&ref_url=https%253A%252F%252Fwww.ti.com%252Fproduct%252FADC128S022%253Fqgpn%253Dadc128s022>; DKPN: 296-38561-1-ND; MANUFACTURER: Texas Instruments; MOPN: 926-A128S022CIMTXNPB; MPN: ADC128S022CIMTX/NOPB
U8-U10 U27 U34 U37 U39 U41 U43 = HyTechDevices:OPAMP_1_CHANNEL_*: Op-Amp 1 Channel OPA991 Datasheet <https://www.ti.com/lit/ds/symlink/opa991.pdf?ts=1615503614502> Note: OPA991 is also a comparator; DKPN: 296-OPA991IDCKRCT-ND; MANUFACTURER: Texas Instruments; MOPN: 595-OPA991IDCKR; MPN: OPA991IDCKR
U11-U13 U28 U38 = HyTechDevices:LOGICGATE_OR: OR Gate SN74LVC Datasheet <https://www.ti.com/lit/ds/symlink/sn74lvc1g34.pdf>; DKPN: 296-22348-2-ND; MANUFACTURER: Texas Instruments; MOPN: 595-SN74LVC32IDCKREP; MPN: SN74LVC1G32IDCKREP
U14-U22 U24 U25 = HyTechDevices:MAX74*: 8th-Order Maxim Filter MAX7480 Datasheet <https://www.mouser.com/datasheet/2/256/MAX7480-1515905.pdf> MAX7400 Datsheet <https://www.mouser.com/datasheet/2/256/MAX7404-1514314.pdf> Recommended clock capacitor for the MAX7400/MAX7404: 885012006013 <https://www.mouser.com/datasheet/2/445/885012006013-1726946.pdf>; DKPN: MAX7400CSA+-ND; MANUFACTURER: Maxim Integrated; MOPN: 700-MAX7400CSA; MPN: MAX7400CSA+
U42 = HyTechDevices:LOGICGATE_AND_: AND Gate SN74LVC Datasheet <https://www.ti.com/lit/ds/symlink/sn74lvc1g08.pdf>; DKPN: 296-SN74LVC1G08DCK3TR-ND; MANUFACTURER: Texas Instruments; MOPN: 595-SN74LVC1G08DCK3; MPN: SN74LVC1G08DCK3
U44 = HyTechDevices:LOGICGATE_NOR: NOR Gate SN74LVC Datasheet <https://www.ti.com/lit/ds/symlink/sn74lvc1g02.pdf>; DKPN: 296-11598-1-ND; MANUFACTURER: Texas Instruments; MOPN: 595-SN74LVC1G02DCKR; MPN: SN74LVC1G02DCKR
VR1 = HyTechDevices:RESISTOR_TRIMPOT_*_?: Variable Resistor Bourns 3362P Datasheet <https://www.mouser.com/datasheet/2/54/3362-776956.pdf>; DKPN: 3362P-103LF-ND; MANUFACTURER: Bourns Inc.; MOPN: 652-3362P-1-103LF; MPN: 3362P-1-103LF; POWER: 0.5W; RESISTANCE: 10k; TOLERANCE: 10%; VOLTAGE: 70.711V
XB1 = HyTechDevices:BATTERY_HOLDER_*: Keystone 498 1/3N Cell Holder PN for the holder; if 1/3N batteries needed, order separately. Datasheet <https://www.mouser.com/datasheet/2/215/98-745913.pdf>; BATTERY_TYPE: 1/3N; DKPN: 36-498-ND; MANUFACTURER: Keystone Electronics; MOPN: 534-498; MPN: 498